# EAGLE design SparkFun_GNSS_mosaic-X5 (EAGLE 9.6.2)
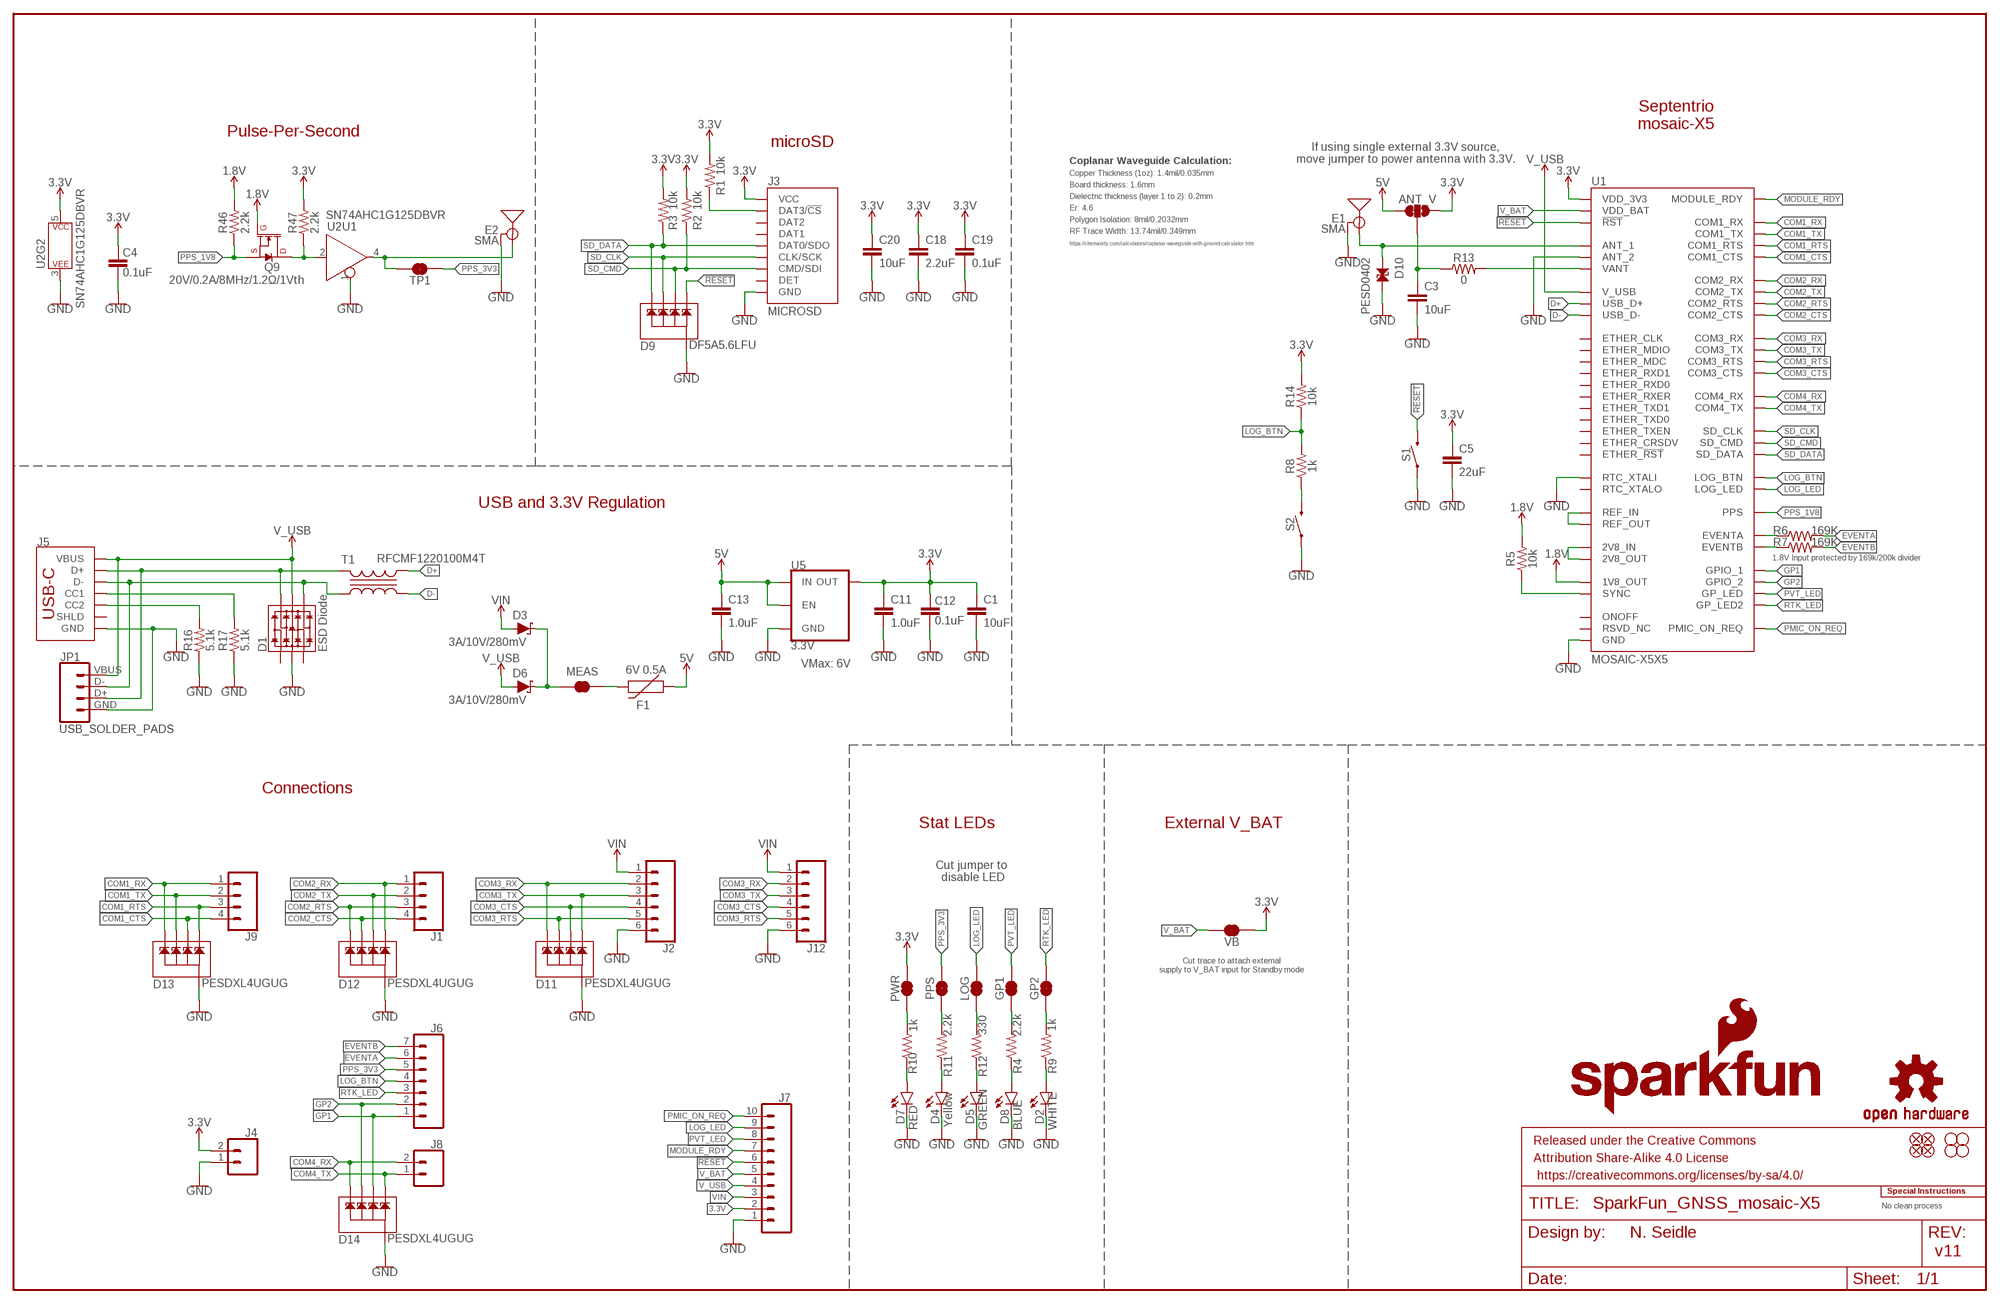
[diagram p0: schematic, sheet 1]

## Parts
ANT_V  JUMPER-SMT_3_1-NC_TRACE_SILK  [SMT-JUMPER_3_1-NC_TRACE_SILK]
C1  10uF  10UF-0603-6.3V-20%  [0603]
C3  10uF  10UF-0603-6.3V-20%  [0603]
C4  0.1uF  0.1UF-0603-25V-5%  [0603]
C5  22uF  22UF-0603-6.3V-20%  [0603]
C11  1.0uF  1.0UF-0603-16V-10%  [0603]
C12  0.1uF  0.1UF-0603-25V-5%  [0603]
C13  1.0uF  1.0UF-0603-16V-10%  [0603]
C18  2.2uF  2.2UF-0603-10V-20%  [0603]
C19  0.1uF  0.1UF-0603-25V-5%  [0603]
C20  10uF  10UF-0603-6.3V-20%  [0603]
D1  ESD Diode  TVS_DIODE_ARRAY_DT1042-04SO-7  [SOT-23-6]
D2  WHITE  LED-WHITE0603  [LED-0603]
D3  3A/10V/280mV  DIODE-SCHOTTKY-BAT60A  [SOD-323]
D4  Yellow  LED-YELLOW0603  [LED-0603]
D5  GREEN  LED-GREEN0603  [LED-0603]
D6  3A/10V/280mV  DIODE-SCHOTTKY-BAT60A  [SOD-323]
D7  RED  LED-RED0603  [LED-0603]
D8  BLUE  LED-BLUE0603  [LED-0603]
D9  DF5A5.6LFU  DF5A5.6LFUUG  [SOT353]
D10  PESD0402  PESD0402-0402T  [0402-TIGHT]
D11  PESDXL4UGUG  [SOT353]
D12  PESDXL4UGUG  [SOT353]
D13  PESDXL4UGUG  [SOT353]
D14  PESDXL4UGUG  [SOT353]
E1  SMA  ANTENNA-SMA-GROUNDEDEDGE_SMA  [SMA-EDGE]
E2  SMA  ANTENNA-SMA-GROUNDEDEDGE_SMA  [SMA-EDGE]
F1  6V 0.5A  PPTC_6V500MA  [0805]
FRAME2  FRAME-LEDGER  [CREATIVE_COMMONS]
GP1  JUMPER-SMT_2_NC_TRACE_SILK  [SMT-JUMPER_2_NC_TRACE_SILK]
GP2  JUMPER-SMT_2_NC_TRACE_SILK  [SMT-JUMPER_2_NC_TRACE_SILK]
H1  STAND-OFF  [STAND-OFF]
H2  STAND-OFF  [STAND-OFF]
H3  STAND-OFF  [STAND-OFF]
H4  STAND-OFF  [STAND-OFF]
J1  CONN_041X04_NO_SILK_NO_POP  [1X04_NO_SILK]
J2  CONN_06JST-SMD-LOCKING  [JST-6-SMD-1.25MM-LOCKING]
J3  MICROSD  MICRO-SD-PUSH-PUSH-EXT-PIN  [MICROSD-EXTERNALPIN]
J4  CONN_021X02_NO_SILK  [1X02_NO_SILK]
J5  USB Female Type C Connector  USB_C_4-LAYER_PADS  [USB-C-16P_4LAYER-PADS]
J6  CONN_07NO_SILK  [1X07_NO_SILK]
J7  CONN_10NO_SILK_PTH_FEMALE  [1X10_NO_SILK]
J8  CONN_021X02_NO_SILK  [1X02_NO_SILK]
J9  CONN_041X04_NO_SILK_NO_POP  [1X04_NO_SILK]
J12  CONN_06PAD  [1X06_SOLDER_PADS]
JP1  USB_SOLDER_PADS  [USB-SOLDER-PADS]
JP21  FIDUCIALUFIDUCIAL  [FIDUCIAL-MICRO]
JP61  FIDUCIALUFIDUCIAL  [FIDUCIAL-MICRO]
JP71  FIDUCIALUFIDUCIAL  [FIDUCIAL-MICRO]
JP81  FIDUCIALUFIDUCIAL  [FIDUCIAL-MICRO]
LOG  JUMPER-SMT_2_NC_TRACE_SILK  [SMT-JUMPER_2_NC_TRACE_SILK]
LOGO2  OSHW-LOGOMINI  [OSHW-LOGO-MINI]
LOGO4  SFE_LOGO_NAME_FLAME10_MM  [SFE_LOGO_NAME_FLAME_10MM]
MEAS  JUMPER-COMBO_2_NC_TRACE  [COMBO-JUMPER_2_NC_TRACE]
PPS  JUMPER-SMT_2_NC_TRACE_SILK  [SMT-JUMPER_2_NC_TRACE_SILK]
PWR  JUMPER-SMT_2_NC_TRACE_SILK  [SMT-JUMPER_2_NC_TRACE_SILK]
Q9  20V/0.2A/8MHz/1.2Ω/1Vth  MOSFET-NCH-RE1C002UNTCL  [SOT-416FL]
R1  10k  10KOHM-0603-1/10W-1%  [0603]
R2  10k  10KOHM-0603-1/10W-1%  [0603]
R3  10k  10KOHM-0603-1/10W-1%  [0603]
R4  2.2k  2.2KOHM-0603-1/10W-1%  [0603]
R5  10k  10KOHM-0603-1/10W-1%  [0603]
R6  169K  169KOHM  [0603]
R7  169K  169KOHM  [0603]
R8  1k  1KOHM-0603-1/10W-1%  [0603]
R9  1k  1KOHM-0603-1/10W-1%  [0603]
R10  1k  1KOHM-0603-1/10W-1%  [0603]
R11  2.2k  2.2KOHM-0603-1/10W-1%  [0603]
R12  330  330OHM-0603-1/10W-1%  [0603]
R13  0  0OHM-0603-1/10W  [0603]
R14  10k  10KOHM-0603-1/10W-1%  [0603]
R16  5.1k  5.1KOHM5.1KOHM-0603-1/10W-1%  [0603]
R17  5.1k  5.1KOHM5.1KOHM-0603-1/10W-1%  [0603]
R46  2.2k  2.2KOHM-0603-1/10W-1%  [0603]
R47  2.2k  2.2KOHM-0603-1/10W-1%  [0603]
S1  MOMENTARY-SWITCH-SPST-SMD-4.6X2.8MM  [TACTILE_SWITCH_SMD_4.6X2.8MM]
S2  MOMENTARY-SWITCH-SPST-SMD-5.2-TALL-REDUNDANT  [TACTILE_SWITCH_SMD_5.2MM]
T1  RFCMF1220100M4T  TRANSFORMER0508  [RFCMF1220100M4T]
TP1  JUMPER-SMT_2_NC_TRACE_SILK  [SMT-JUMPER_2_NC_TRACE_SILK]
U1  MOSAIC-X5X5  [MOSAIC_LGA]
U2  SN74AHC1G125DBVR  74AHC1G125SN74AHC1G125DBVR  [SOT23-5]
U5  3.3V  V_REG_AP2112K-3.3V  [SOT23-5]
U$2  SPECIAL_INSTRUCTIONS-ORDERING  [ORDERING_INSTRUCTIONS]
VB  JUMPER-SMT_2_NC_TRACE_SILK  [SMT-JUMPER_2_NC_TRACE_SILK]

## Nets
1.8V: Q9.1(G) R5.2 R46.2 U1.AC4(1V8_OUT)
3.3V [power]: ANT_V.1 C1.1 C4.2 C5.1 C11.1 C12.2 C18.1 C19.1 C20.1 J3.4(VCC) J4.2 J7.2 PWR.2 R1.2 R2.2 R3.2 R14.2 R47.2 U1.A18(VDD_3V3) U1.A19(VDD_3V3) U1.A20(VDD_3V3) U1.B18(VDD_3V3) U1.B19(VDD_3V3) U1.B20(VDD_3V3) U1.C18(VDD_3V3) U1.C19(VDD_3V3) U1.C20(VDD_3V3) U2.5(P$V+) U5.5(OUT) VB.1
5V: ANT_V.3 C13.1 F1.1 U5.1(IN) U5.3(EN)
!RESET!: D9.3 J7.6 S1.3 S1.4 U1.A11(!RST!)
ANT_V: ANT_V.2 C3.1 R13.1
CC1: J5.A5(CC1) R17.2
CC2: J5.B5(CC2) R16.2
COM1_CTS: D13.4 J9.4 U1.E1(COM1_CTS)
COM1_RTS: D13.3 J9.3 U1.C1(COM1_RTS)
COM1_RX: D13.1 J9.1 U1.B1(COM1_RX)
COM1_TX: D13.5 J9.2 U1.D1(COM1_TX)
COM2_CTS: D12.5 J1.4 U1.J1(COM2_CTS)
COM2_RTS: D12.1 J1.3 U1.G1(COM2_RTS)
COM2_RX: D12.3 J1.1 U1.F1(COM2_RX)
COM2_TX: D12.4 J1.2 U1.H1(COM2_TX)
COM3_CTS: D11.4 J2.4 J12.4 U1.N1(COM3_CTS)
COM3_RTS: D11.5 J2.5 J12.5 U1.L1(COM3_RTS)
COM3_RX: D11.1 J2.2 J12.2 U1.K1(COM3_RX)
COM3_TX: D11.3 J2.3 J12.3 U1.M1(COM3_TX)
COM4_RX: D14.1 J8.2 U1.D3(COM4_RX)
COM4_TX: D14.3 J8.1 U1.E3(COM4_TX)
D+: T1.B2 U1.A5(USB_D+)
D-: T1.A2 U1.A6(USB_D-)
EVENTA: J6.6 R6.2
EVENTB: J6.7 R7.2
GND: C1.2 C3.2 C4.1 C5.2 C11.2 C12.1 C13.2 C18.2 C19.2 C20.2 D1.2(VSS) D2.C D4.C D5.C D7.C D8.C D9.2 D10.2 D11.2 D12.2 D13.2 D14.2 E1.GND@0(GND) E1.GND@1(GND) E1.GND@2(GND) E1.GND@3(GND) E2.GND@0(GND) E2.GND@1(GND) E2.GND@2(GND) E2.GND@3(GND) J2.6 J3.6(GND) J3.10(GND) J3.11(GND) J3.12(GND) J3.13(GND) J4.1 J5.GND J5.GND2(GND) J7.1 J12.6 JP1.GND R16.1 R17.1 S1.1 S1.2 S2.1 S2.2 U1.A3(RTC_XTALI) U1.A4(GND) U1.A7(GND) U1.A15(GND) U1.A16(GND) U1.A17(GND) U1.A21(GND) U1.A22(GND) U1.A23(GND) U1.AA13(GND) U1.AA14(GND) U1.AA15(GND) U1.AA16(GND) U1.AA17(GND) U1.AA18(GND) U1.AA19(GND) U1.AA20(GND) U1.AA21(GND) U1.AA22(GND) U1.AA23(GND) U1.AB2(GND) U1.AB3(GND) U1.AB4(GND) U1.AB5(GND) U1.AB6(GND) U1.AB7(GND) U1.AB8(GND) U1.AB13(GND) U1.AB14(GND) U1.AB15(GND) U1.AB16(GND) U1.AB17(GND) U1.AB18(GND) U1.AB19(GND) U1.AB20(GND) U1.AB21(GND) U1.AB22(GND) U1.AB23(GND) U1.AC13(GND) U1.AC15(GND) U1.AC18(GND) U1.AC19(GND) U1.AC21(GND) U1.AC22(GND) U1.AC23(GND) U1.B4(GND) U1.B5(GND) U1.B6(GND) U1.B7(GND) U1.B13(GND) U1.B17(GND) U1.B21(GND) U1.C4(GND) U1.C7(GND) U1.C15(GND) U1.C16(GND) U1.C17(GND) U1.C23(GND) U1.D2(GND) U1.D21(GND) U1.D22(GND) U1.D23(GND) U1.E2(GND) U1.E21(GND) U1.E22(GND) U1.E23(GND) U1.F21(GND) U1.F22(GND) U1.F23(GND) U1.G2(GND) U1.G21(GND) U1.G23(GND) U1.H21(GND) U1.H22(GND) U1.H23(GND) U1.J21(GND) U1.J22(GND) U1.J23(GND) U1.K2(GND) U1.K21(GND) U1.K22(GND) U1.K23(GND) U1.L21(GND) U1.L22(GND) U1.L23(GND) U1.M21(GND) U1.M22(GND) U1.N21(GND) U1.N22(GND) U1.P1(GND) U1.P2(GND) U1.P3(GND) U1.P21(GND) U1.P22(GND) U1.R3(GND) U1.R21(GND) U1.R22(GND) U1.T21(GND) U1.T22(GND) U1.T23(GND) U1.U2(GND) U1.U21(GND) U1.U22(GND) U1.U23(GND) U1.V21(GND) U1.V22(GND) U1.V23(ANT_2) U1.W21(GND) U1.W22(GND) U1.W23(GND) U1.Y2(GND) U1.Y21(GND) U1.Y22(GND) U1.Y23(GND) U2.1(U1:!EN) U2.3(P$V-) U5.2(GND)
GP1: D14.4 J6.1 U1.AA4(GPIO_1)
GP2: D14.5 J6.2 U1.L3(GPIO_2)
GPS_ANT1 [RF]: D10.1 E1.SIG(SIGNAL) U1.AC20(ANT_1)
LOG_BTN: J6.4 R8.2 R14.1 U1.K3(LOG_BTN)
LOG_LED: J7.9 LOG.2 U1.B2(LOG_LED)
MEAS: D3.C D6.C MEAS.2 MEAS.4
MODULE_RDY: J7.7 U1.A12(MODULE_RDY)
N$1: R8.1 S2.3 S2.4
N$2: D4.A R11.1
N$3: PPS.1 R11.2
N$4: F1.2 MEAS.1 MEAS.3
N$5: J3.2(DAT3/!CS!) R1.1
N$6: R6.1 U1.AC6(EVENTA)
N$7: R7.1 U1.AC7(EVENTB)
N$8: D2.A R9.1
N$9: GP2.1 R9.2
N$10: U1.AC16(REF_OUT) U1.AC17(REF_IN)
N$11: D8.A R4.1
N$12: GP1.1 R4.2
N$14: D7.A R10.1
N$15: U1.M23(2V8_IN) U1.N23(2V8_OUT)
N$16: D5.A R12.1
N$17: LOG.1 R12.2
N$20: PWR.1 R10.2
N$26: R5.1 U1.AC3(SYNC)
PMIC_ON_REQ: J7.10 U1.B16(PMIC_ON_REQ)
PPS: E2.SIG(SIGNAL) TP1.2 U2.4(U1:Y)
PPS_1V8: Q9.2(S) R46.1 U1.AC8(PPS)
PPS_3: Q9.3(D) R47.1 U2.2(U1:A)
PPS_3V3: J6.5 PPS.2 TP1.1
PVT_LED: GP1.2 J7.8 U1.A14(GP_LED)
RTK_LED: GP2.2 J6.3 U1.M3(GP_LED2)
SD_CLK: D9.5 J3.5(CLK/SCK) U1.AA1(SD_CLK)
SD_CMD: D9.4 J3.3(CMD/SDI) R2.1 U1.AB1(SD_CMD)
SD_DATA: D9.1 J3.7(DAT0/SDO) R3.1 U1.Y1(SD_DATA)
USB_D+: D1.6(IO4) J5.A6(D+) J5.B6(D+) JP1.D+ T1.B1
USB_D-: D1.4(IO3) J5.A7(D-) J5.B7(D-) JP1.D- T1.A1
V_BAT: J7.5 U1.B8(VDD_BAT) VB.2
V_USB: D1.5(VCC) D6.A J5.VBUS1(VBUS) J5.VBUS2(VBUS) J7.4 JP1.VBUS U1.A8(V_USB)
VANT: R13.2 U1.P23(VANT) U1.R23(VANT)
VIN: D3.A J2.1 J7.3 J12.1
Unconnected: D1.1(IO1) D1.3(IO2) J3.1(DAT2) J3.8(DAT1) J3.9(DET) J5.SHLD1(SHLD) J5.SHLD2(SHLD) J5.SHLD3(SHLD) J5.SHLD4(SHLD) U1.A2(RTC_XTALO) U1.A9(RSVD_NC) U1.A10(ONOFF) U1.A13(RSVD_NC) U1.AA2(ETHER_CLK) U1.AA3(RSVD_NC) U1.AA5(RSVD_NC) U1.AA6(RSVD_NC) U1.AA7(RSVD_NC) U1.AA8(RSVD_NC) U1.AA9(RSVD_NC) U1.AA10(RSVD_NC) U1.AA11(RSVD_NC) U1.AA12(RSVD_NC) U1.AB9(RSVD_NC) U1.AB10(RSVD_NC) U1.AB11(RSVD_NC) U1.AB12(RSVD_NC) U1.AC1(RSVD_NC) U1.AC2(RSVD_NC) U1.AC5(RSVD_NC) U1.AC9(RSVD_NC) U1.AC10(RSVD_NC) U1.AC11(RSVD_NC) U1.AC12(RSVD_NC) U1.AC14(RSVD_NC) U1.B3(RSVD_NC) U1.B9(RSVD_NC) U1.B10(RSVD_NC) U1.B11(RSVD_NC) U1.B12(RSVD_NC) U1.B14(RSVD_NC) U1.B15(RSVD_NC) U1.B22(RSVD_NC) U1.B23(RSVD_NC) U1.C2(RSVD_NC) U1.C3(RSVD_NC) U1.C5(RSVD_NC) U1.C6(RSVD_NC) U1.C8(RSVD_NC) U1.C9(RSVD_NC) U1.C10(RSVD_NC) U1.C11(RSVD_NC) U1.C12(RSVD_NC) U1.C13(RSVD_NC) U1.C14(RSVD_NC) U1.C21(RSVD_NC) U1.C22(RSVD_NC) U1.F2(ETHER_!RST!) U1.F3(RSVD_NC) U1.G3(RSVD_NC) U1.G22(RSVD_NC) U1.H2(ETHER_TXD1) U1.H3(RSVD_NC) U1.J2(ETHER_TXD0) U1.J3(RSVD_NC) U1.L2(ETHER_TXEN) U1.M2(ETHER_RXER) U1.N2(ETHER_CRSDV) U1.N3(RSVD_NC) U1.R1(RSVD_NC) U1.R2(ETHER_RXD0) U1.T1(RSVD_NC) U1.T2(ETHER_RXD1) U1.T3(RSVD_NC) U1.U1(RSVD_NC) U1.U3(RSVD_NC) U1.V1(RSVD_NC) U1.V2(ETHER_MDC) U1.V3(RSVD_NC) U1.W1(RSVD_NC) U1.W2(ETHER_MDIO) U1.W3(RSVD_NC) U1.Y3(RSVD_NC)

## Notes on the sheet
- Septentrio
  mosaic-X5
- Pulse-Per-Second
- microSD
- If using single external 3.3V source,
  move jumper to power antenna with 3.3V.
- Coplanar Waveguide Calculation:
- Copper Thickness (1oz): 1.4mil/0.035mm
- Board thickness: 1.6mm
- Dielectric thickness (layer 1 to 2): 0.2mm
- Er: 4.6
- Polygon Isolation: 8mil/0.2032mm
- RF Trace Width: 13.74mil/0.349mm
- https://chemandy.com/calculators/coplanar-waveguide-with-ground-calculator.htm
- USB and 3.3V Regulation
- 1.8V Input protected by 169k/200k divider
- VMax: 6V
- Connections
- Stat LEDs | External V_BAT
- Cut jumper to 
  disable LED
- Cut trace to attach external
  supply to V_BAT input for Standby mode
- No clean process
- N. Seidle
- v11

## Library data of the parts
ANT_V = SparkFun-Jumpers:JUMPER-SMT_3_1-NC_TRACE: Normally closed trace jumper (1 of 2 connections) This jumper has a trace between two pads so it's normally closed (NC). The other connection is normally open (NO). Use a razor knife to open the connection. For best results follow the IPC guidelines for cutting traces: Cutout at least 0.063 mm (0.005 in). Remove all loose material to clean up the cut area. Seal the cut with an approved epoxy. Reapply solder to reclose the connection, or to close the NO connection.
C1 C3 C20 = SparkFun-Capacitors:10UF: 10.0µF ceramic capacitors A capacitor is a passive two-terminal electrical component used to store electrical energy temporarily in an electric field.; PROD_ID: CAP-11015
C4 C12 C19 = SparkFun-Capacitors:0.1UF: 0.1µF ceramic capacitors A capacitor is a passive two-terminal electrical component used to store electrical energy temporarily in an electric field.; PROD_ID: CAP-08604
C5 = SparkFun-Capacitors:22UF: 22µF ceramic capacitors A capacitor is a passive two-terminal electrical component used to store electrical energy temporarily in an electric field.; PROD_ID: CAP-14464
C11 C13 = SparkFun-Capacitors:1.0UF: 1µF ceramic capacitors A capacitor is a passive two-terminal electrical component used to store electrical energy temporarily in an electric field.; PROD_ID: CAP-00868
C18 = SparkFun-Capacitors:2.2UF: 2.2µF ceramic capacitors A capacitor is a passive two-terminal electrical component used to store electrical energy temporarily in an electric field.; PROD_ID: CAP-07888
D1 = SparkFun-DiscreteSemi:TVS_DIODE_ARRAY; PROD_ID: IC-13538
D2 = SparkFun-LED:LED-WHITE: White SMD LED Used in manufacturing several products at SparkFun. Packages: 0603 - Bright White SMD 0603 package[Product Link] <http://www.kingbrightusa.com/product.asp?catalog_name=LED&product_id=APT1608QWF/D> 1206 - Bright White SMD1206 package [Product Link] <http://www.kingbrightusa.com/product.asp?catalog_name=LED&product_id=APT3216QWF/D> 3014 - Super Bright SMD 3014 package [Datasheet] <http://www.lumileds.com/uploads/459/DS208-pdf> SparkFun Products: Blackberry Trackballer Breakout <https://www.sparkfun.com/products/13169> Digital SandBox <https://www.sparkfun.com/products/12651>; PROD_ID: DIO-09004
D3 D6 = SparkFun-DiscreteSemi:DIODE-SCHOTTKY: Schottky diode A Schottky diode is a semiconductor diode which has a low forward voltage drop and a very fast switching action.; PROD_ID: DIO-14072
D4 = SparkFun-LED:LED-YELLOW: Yellow SMD LED Used in manufacturing several products at SparkFun. Packages: 0603 - SMD 0603 package[Product Link] <http://www.kingbrightusa.com/product.asp?catalog_name=LED&product_id=APT1608SYCK> 0603 -SMART - SMART SMD 0603 package (more efficient/more expensive) [Product Link] <http://www.osram-os.com/osram_os/en/products/product-catalog/led-light-emitting-diodes/smartled-0603/ly-l29k/index.jsp> LilyPad - SMD1206 package[Product Datasheet] <https://www.sparkfun.com/datasheets/DevTools/LilyPad/Q150YUS4.pdf> SparkFun Products: Blynk Board <https://www.sparkfun.com/products/13794> IOIO-OTG <https://www.sparkfun.com/products/13613> XBee Explorer Serial <https://www.sparkfun.com/products/13225>; PROD_ID: DIO-09003
D5 = SparkFun-LED:LED-GREEN: Green SMD LED Used in manufacturing of various products at SparkFun Packages: 0603 - SMD 0603 package [Product Link] <http://www.futureelectronics.com/en/technologies/semiconductors/optoelectronics/leds/Pages/9894312-LTST-C190GKT.aspx?CrossPart=HSMG-C190&IM=0> LilyPad 1206 - SMD1206 LilyPad package [Product Link] <http://www.futureelectronics.com/en/Technologies/Product.aspx?ProductID=IN150NGHARVATEKCORPORATION2049943&IM=0> 1206 - SMD1206 package [Product Link] <http://www.futureelectronics.com/en/technologies/semiconductors/optoelectronics/leds/Pages/8315665-LTST-C150KGKT.aspx?IM=0> 1206 Bottom Mount -SMD 1206 Bottom Mount [Product Link] <http://www.digikey.com/product-detail/en/lite-on-inc/LTST-C230KGKT/160-1456-1-ND/386854> SparkFun Products: Pro Mini 328 -5V <https://www.sparkfun.com/products/821> RedBoard <https://www.sparkfun.com/products/12757> MP3 Trigger <https://www.sparkfun.com/products/13720> Makey Makey <https://www.sparkfun.com/products/11076>; PROD_ID: DIO-00821
D7 = SparkFun-LED:LED-RED: Red SMD LED Used in manufacturing of most products at SparkFun Packages: 0603 - KB - KingBright (DIO-17976) SMD 0603 package [Datasheet] <https://www.kingbrightusa.com/images/catalog/SPEC/APT1608SURCK.pdf> 0603 - (DIO-00819, has gone EOL) SMD 0603 package 0603 SMART - SMD 0603 SMART package ( more efficient and expensive)[Product Link] <http://www.osram-os.com/Graphics/XPic2/00077099_0.pdf> 1206 - SMD1206 package [Product Link] <https://www.sparkfun.com/datasheets/DevTools/LilyPad/Q150OVS4.pdff> SparkFun Products: Pro Mini 328 -5V <https://www.sparkfun.com/products/821> RedBoard <https://www.sparkfun.com/products/12757> IOIO-OTG <https://www.sparkfun.com/products/13613>; PROD_ID: DIO-00819
D8 = SparkFun-LED:LED-BLUE: Blue SMD LED Used in manufacturing of various products at SparkFun Packages: 0603 - SMD 0603 package [Product Link] <http://www.digikey.com/product-detail/en/SMLE12BC7TT86/511-1589-2-ND/1641808> 1206 - SMD1206 package [Product Link] <http://www.digikey.com/product-detail/en/lite-on-inc/LTST-C150TBKT/160-1643-1-ND/573584> SparkFun Products: ESP8266 Thing-Dev Board <https://www.sparkfun.com/products/13711> RedBoard <https://www.sparkfun.com/products/12757>; PROD_ID: DIO-08575
D9 = SparkFun-DiscreteSemi:DF5A5.6LFU; PROD_ID: DIO-20454
D10 = SparkFun-DiscreteSemi:PESD0402: ESD protection diode PESD is used to protect a signal line from ESD.; PROD_ID: DIO-15359
D11-D14 = SparkFun-DiscreteSemi:PESDXL4UG; PROD_ID: DIO-19494
E1 E2 = SparkFun-RF:ANTENNA-SMA-GROUNDED: SMA Antenna Connector w/ Ground Edge-mount and SMD SMA connectors for RF Antennas. **4-LAYER BOARD WARNING!!** When designing a 4-layer board using any of the SMD variants, you will need to manually add a cutout polygon on any internal power layers to make sure that you don't end up with exposed copper around the edge of the routed hole for these connectors. Exposed power copper could then short to the connector body - and that would be bad. Why hasn't anyone added the cutout polygons directly to the connector footprint? Well, your internal layers (usually 2 and 15) may be covered with GND polygons and you might well want the copper to go all the way to the edge, especially under the connector SIGNAL pin. So adding cutouts to the footprint might make matters worse, not better...; PROD_ID: CONN-08289
F1 = SparkFun-Fuses:PPTC: Resettable Fuse PPTC Resettable Fuse. Really a sort of resistor with a polymeric positive temperature coefficient whose resistance increases dramatically with an increase in temperature. When heated by the power passing through the resistance rises causing the current to be limited, protecting the circuit. This is achieved by the transition of the polymer from a crystalline to an amorphous state where the conductive carbon separates breaking the conductive pathways found in the cool crystalline structure. When a PPTC cools back down it resumes conducting letting the circuit turn back on. SparkFun Products: SparkFun RedBoard - Programmed with Arduino <https://www.sparkfun.com/products/12757> Pro Micro - 5V/16MHz <https://www.sparkfun.com/products/12640> Arduino Pro 328 - 5V/16MHz <https://www.sparkfun.com/products/10915> MP3 Trigger <https://www.sparkfun.com/products/13720>; PROD_ID: RES-13945
FRAME2 = SparkFun-Aesthetics:FRAME-LEDGER: Schematic Frame - Ledger Standard 11x14 US Ledger frame
GP1 GP2 LOG PPS PWR TP1 VB = SparkFun-Jumpers:JUMPER-SMT_2_NC_TRACE: Normally closed trace jumper This jumper has a trace between two pads so it's normally closed (NC). Use a razor knife to open the connection. For best results follow the IPC guidelines for cutting traces: Cutout at least 0.063 mm (0.005 in). Remove all loose material to clean up the cut area. Seal the cut with an approved epoxy. Reapply solder to reclose the connection.
H1-H4 = SparkFun-Hardware:STAND-OFF: Stand Off Drill holes for mechanically mounting via screws, standoffs, etc. Note: Use the keepout ring to avoid running the screw head into surrounding components. Variant Overviews STAND-OFF - Mechanical footprint for a #4 phillips button head screw. STAND-OFF-TIGHT - Mechanical footprint for a #4 phillips button head screw, Example SparkFun Products Screw - Phillips Head (1/4", 4-40, 10 pack) <https://www.sparkfun.com/products/10453> (PRT-10453) Screw - Phillips Head (1/2", 4-40, 10 pack) <https://www.sparkfun.com/products/10452> (PRT-10452) Screw - Phillips Head (3/4", 4-40, 10 pack) <https://www.sparkfun.com/products/10451> (PRT-10451) Screw - Phillips Head (1", 4-40, 10 pack) <https://www.sparkfun.com/products/10450> (PRT-10450)
J1 J9 = SparkFun-Connectors:CONN_04: Multi connection point. Often used as Generic Header-pin footprint for 0.1 inch spaced/style header connections On any of the 0.1 inch spaced packages, you can populate with these: Break Away Headers - Straight <https://www.sparkfun.com/products/116> (PRT-00116) Break Away Male Headers - Right Angle <https://www.sparkfun.com/products/553> (PRT-00553) Female Headers <https://www.sparkfun.com/products/115> (PRT-00115) Break Away Headers - Machine Pin <https://www.sparkfun.com/products/117> (PRT-00117) Break Away Female Headers - Swiss Machine Pin <https://www.sparkfun.com/products/743> (PRT-00743) For SCREWTERMINALS and SPRING TERMINALS visit here: Screw Terimnals on SparkFun.com <https://www.sparkfun.com/search/results?term=Screw+Terminals> (5mm/3.5mm/2.54mm spacing) This device is also useful as a general connection point to wire up your design to another part of your project. Our various solder wires solder well into these plated through hole pads. Hook-Up Wire - Assortment (Stranded, 22 AWG) <https://www.sparkfun.com/products/11375> (PRT-11375) Hook-Up Wire - Assortment (Solid Core, 22 AWG) <https://www.sparkfun.com/products/11367> (PRT-11367) View the entire wire category on our website here <https://www.sparkfun.com/categories/141> Special notes: Molex polarized connector foot print use with SKU : PRT-08231 with associated crimp pins and housings. 1MM SMD Version SKU: PRT-10208
J2 = SparkFun-Connectors:CONN_06: Multi connection point. Often used as Generic Header-pin footprint for 0.1 inch spaced/style header connections On any of the 0.1 inch spaced packages, you can populate with these: Break Away Headers - Straight <https://www.sparkfun.com/products/116> (PRT-00116) Break Away Male Headers - Right Angle <https://www.sparkfun.com/products/553> (PRT-00553) Female Headers <https://www.sparkfun.com/products/115> (PRT-00115) Break Away Headers - Machine Pin <https://www.sparkfun.com/products/117> (PRT-00117) Break Away Female Headers - Swiss Machine Pin <https://www.sparkfun.com/products/743> (PRT-00743) Arduino Stackable Header - 6 Pin <https://www.sparkfun.com/products/9280> (PRT-09280) Screw Terminals 2.54mm Pitch (6-Pin) <https://www.sparkfun.com/products/16499> (PRT-16499) For SCREWTERMINALS and SPRING TERMINALS visit here: Screw Terimnals on SparkFun.com <https://www.sparkfun.com/search/results?term=Screw+Terminals> (5mm/3.5mm/2.54mm spacing) This device is also useful as a general connection point to wire up your design to another part of your project. Our various solder wires solder well into these plated through hole pads. Hook-Up Wire - Assortment (Stranded, 22 AWG) <https://www.sparkfun.com/products/11375> (PRT-11375) Hook-Up Wire - Assortment (Solid Core, 22 AWG) <https://www.sparkfun.com/products/11367> (PRT-11367) View the entire wire category on our website here <https://www.sparkfun.com/categories/141>; PROD_ID: CONN-16497
J3 = SparkFun-Connectors:MICRO-SD: microSD Socket for Transflash Various sockets for µSD. tDoc lines correctly indicate media card edge positions when inserting (unlocked, locked, depressed). NOTE: CD1 and CD2 are connected internally, and the default detect state of the socket is detect pin to ground. SparkFun Products: WAV Trigger <https://www.sparkfun.com/products/13660> CAN-Bus Shield <https://www.sparkfun.com/products/13262> SparkFun Level Shifing microSD Breakout <https://www.sparkfun.com/products/13743>; PROD_ID: CONN-16110
J4 J8 = SparkFun-Connectors:CONN_02: Multi connection point. Often used as Generic Header-pin footprint for 0.1 inch spaced/style header connections On any of the 0.1 inch spaced packages, you can populate with these: Break Away Headers - Straight <https://www.sparkfun.com/products/116> (PRT-00116) Break Away Male Headers - Right Angle <https://www.sparkfun.com/products/553> (PRT-00553) Female Headers <https://www.sparkfun.com/products/115> (PRT-00115) Break Away Headers - Machine Pin <https://www.sparkfun.com/products/117> (PRT-00117) Break Away Female Headers - Swiss Machine Pin <https://www.sparkfun.com/products/743> (PRT-00743) For SCREWTERMINALS and SPRING TERMINALS visit here: Screw Terimnals on SparkFun.com <https://www.sparkfun.com/search/results?term=Screw+Terminals> (5mm/3.5mm/2.54mm spacing) This device is also useful as a general connection point to wire up your design to another part of your project. Our various solder wires solder well into these plated through hole pads. Hook-Up Wire - Assortment (Stranded, 22 AWG) <https://www.sparkfun.com/products/11375> (PRT-11375) Hook-Up Wire - Assortment (Solid Core, 22 AWG) <https://www.sparkfun.com/products/11367> (PRT-11367) View the entire wire category on our website here <https://www.sparkfun.com/categories/141> Special notes: Molex polarized connector foot print use with: PRT-08233 with associated crimp pins and housings. 2.54_SCREWTERM for use with PRT-10571. 3.5mm Screw Terminal footprints for PRT-08084 5mm Screw Terminal footprints for use with PRT-08432
J5 = SparkFun-Connectors:USB_C: USB Type C 16Pin Connector Super Speed pins not available on the 16-pin purely SMD connector so this part is best for USB 2.0 implementations. D1 and D2 are tied together enabling D+/- no matter which way the cable is plugged into the connector. The two channel configuration pins (CC1/2) are exposed. These are normally connected to ground via 5.1k resistors but can be reconfigured for high current/high power applications. **4-LAYER BOARD WARNING!!** If designing 4-layer board, make sure to select the variant _4-LAYER-ISOLATED. The linked footprint (USB-C-16-4LAYER-ISOLATED) includes some very necessary cutout polygons in the inner layers (2 and 15). This prevents the PTH mounting shield legs on the USB connector from electrically connecting any other polygons on the inner layers (usually VCC and GND).; PROD_ID: CONN-14122
J6 = SparkFun-Connectors:CONN_07: Multi connection point. Often used as Generic Header-pin footprint for 0.1 inch spaced/style header connections On any of the 0.1 inch spaced packages, you can populate with these: Break Away Headers - Straight <https://www.sparkfun.com/products/116> (PRT-00116) Break Away Male Headers - Right Angle <https://www.sparkfun.com/products/553> (PRT-00553) Female Headers <https://www.sparkfun.com/products/115> (PRT-00115) Break Away Headers - Machine Pin <https://www.sparkfun.com/products/117> (PRT-00117) Break Away Female Headers - Swiss Machine Pin <https://www.sparkfun.com/products/743> (PRT-00743) For SCREWTERMINALS and SPRING TERMINALS visit here: Screw Terimnals on SparkFun.com <https://www.sparkfun.com/search/results?term=Screw+Terminals> (5mm/3.5mm/2.54mm spacing) This device is also useful as a general connection point to wire up your design to another part of your project. Our various solder wires solder well into these plated through hole pads. Hook-Up Wire - Assortment (Stranded, 22 AWG) <https://www.sparkfun.com/products/11375> (PRT-11375) Hook-Up Wire - Assortment (Solid Core, 22 AWG) <https://www.sparkfun.com/products/11367> (PRT-11367) View the entire wire category on our website here <https://www.sparkfun.com/categories/141> Special notes: Molex polarized connector foot print use with SKU : PRT-08231 with associated crimp pins and housings. 1MM SMD Version SKU: PRT-10208 NOTES ON THE VARIANTS LOCK and LOCK_LONGPADS... This footprint was designed to help hold the alignment of a through-hole component (i.e. 6-pin header) while soldering it into place. You may notice that each hole has been shifted either up or down by 0.005 of an inch from it's more standard position (which is a perfectly straight line). This slight alteration caused the pins (the squares in the middle) to touch the edges of the holes. Because they are alternating, it causes a "brace" to hold the component in place. 0.005 has proven to be the perfect amount of "off-center" position when using our standard breakaway headers. Although looks a little odd when you look at the bare footprint, once you have a header in there, the alteration is very hard to notice. Also,if you push a header all the way into place, it is covered up entirely on the bottom side.
J7 = SparkFun-Connectors:CONN_10: Multi connection point. Often used as Generic Header-pin footprint for 0.1 inch spaced/style header connections On any of the 0.1 inch spaced packages, you can populate with these: Break Away Headers - Straight <https://www.sparkfun.com/products/116> (PRT-00116) Break Away Male Headers - Right Angle <https://www.sparkfun.com/products/553> (PRT-00553) Female Headers <https://www.sparkfun.com/products/115> (PRT-00115) Break Away Headers - Machine Pin <https://www.sparkfun.com/products/117> (PRT-00117) Break Away Female Headers - Swiss Machine Pin <https://www.sparkfun.com/products/743> (PRT-00743) Arduino Stackable Header - 10 Pin <https://www.sparkfun.com/products/11376> (PRT-11376) For SCREWTERMINALS and SPRING TERMINALS visit here: Screw Terimnals on SparkFun.com <https://www.sparkfun.com/search/results?term=Screw+Terminals> (5mm/3.5mm/2.54mm spacing) This device is also useful as a general connection point to wire up your design to another part of your project. Our various solder wires solder well into these plated through hole pads. Hook-Up Wire - Assortment (Stranded, 22 AWG) <https://www.sparkfun.com/products/11375> (PRT-11375) Hook-Up Wire - Assortment (Solid Core, 22 AWG) <https://www.sparkfun.com/products/11367> (PRT-11367) View the entire wire category on our website here <https://www.sparkfun.com/categories/141> Special notes: Molex polarized connector foot print use with SKU : PRT-08231 with associated crimp pins and housings. 1MM SMD Version SKU: PRT-10208 NOTES ON THE VARIANTS LOCK and LOCK_LONGPADS... This footprint was designed to help hold the alignment of a through-hole component (i.e. 6-pin header) while soldering it into place. You may notice that each hole has been shifted either up or down by 0.005 of an inch from it's more standard position (which is a perfectly straight line). This slight alteration caused the pins (the squares in the middle) to touch the edges of the holes. Because they are alternating, it causes a "brace" to hold the component in place. 0.005 has proven to be the perfect amount of "off-center" position when using our standard breakaway headers. Although looks a little odd when you look at the bare footprint, once you have a header in there, the alteration is very hard to notice. Also,if you push a header all the way into place, it is covered up entirely on the bottom side.
J12 = SparkFun-Connectors:CONN_06: Multi connection point. Often used as Generic Header-pin footprint for 0.1 inch spaced/style header connections On any of the 0.1 inch spaced packages, you can populate with these: Break Away Headers - Straight <https://www.sparkfun.com/products/116> (PRT-00116) Break Away Male Headers - Right Angle <https://www.sparkfun.com/products/553> (PRT-00553) Female Headers <https://www.sparkfun.com/products/115> (PRT-00115) Break Away Headers - Machine Pin <https://www.sparkfun.com/products/117> (PRT-00117) Break Away Female Headers - Swiss Machine Pin <https://www.sparkfun.com/products/743> (PRT-00743) Arduino Stackable Header - 6 Pin <https://www.sparkfun.com/products/9280> (PRT-09280) Screw Terminals 2.54mm Pitch (6-Pin) <https://www.sparkfun.com/products/16499> (PRT-16499) For SCREWTERMINALS and SPRING TERMINALS visit here: Screw Terimnals on SparkFun.com <https://www.sparkfun.com/search/results?term=Screw+Terminals> (5mm/3.5mm/2.54mm spacing) This device is also useful as a general connection point to wire up your design to another part of your project. Our various solder wires solder well into these plated through hole pads. Hook-Up Wire - Assortment (Stranded, 22 AWG) <https://www.sparkfun.com/products/11375> (PRT-11375) Hook-Up Wire - Assortment (Solid Core, 22 AWG) <https://www.sparkfun.com/products/11367> (PRT-11367) View the entire wire category on our website here <https://www.sparkfun.com/categories/141>
JP1 = SparkFun-Connectors:USB_SOLDER_PADS: Solder pad access to USB pins. Helpful to expose on PCBs so user can attach external USB connector if necessary.
JP21 JP61 JP71 JP81 = SparkFun-Aesthetics:FIDUCIAL: Fiducial Alignment Points Point-of-reference for pick-and-place machines and other optical instruments.
LOGO2 = SparkFun-Aesthetics:OSHW-LOGO: Open-Source Hardware (OSHW) Logo This logo indicates the piece of hardware it is found on incorporates a OSHW license and/or adheres to the definition of open source hardware found here: http://freedomdefined.org/OSHW
LOGO4 = SparkFun-Aesthetics:SFE_LOGO_NAME_FLAME: SparkFun Font Logo w/ Flame This is the SparkFun full logo. The logo on the schematic will always be the same size; the package variant is the height of the flame part of the logo. Default layer for the logo on the board is tSilk.
MEAS = SparkFun-Jumpers:JUMPER-COMBO_2_NC_TRACE
Q9 = SparkFun-DiscreteSemi:MOSFET-NCH: N-channel MOSFETs Voltage controlled devices that allow control of high current outputs. SparkFun Products: SparkFun OpenScale <https://www.sparkfun.com/products/13261> SparkFun Digital Sandbox <https://www.sparkfun.com/products/12651> SparkFun Monster Moto Shield <https://www.sparkfun.com/products/10182> SparkFun MOSFET Power Controller <https://www.sparkfun.com/products/11214>; PROD_ID: TRANS-14399
R1-R3 R5 R14 = SparkFun-Resistors:10KOHM: 10kΩ resistor A resistor is a passive two-terminal electrical component that implements electrical resistance as a circuit element. Resistors act to reduce current flow, and, at the same time, act to lower voltage levels within circuits. - Wikipedia; PROD_ID: RES-00824
R4 R11 R46 R47 = SparkFun-Resistors:2.2KOHM: 2.2kΩ resistor A resistor is a passive two-terminal electrical component that implements electrical resistance as a circuit element. Resistors act to reduce current flow, and, at the same time, act to lower voltage levels within circuits. - Wikipedia; PROD_ID: RES-08272
R6 R7 = SparkFun-Resistors:169KOHM: 169kΩ resistor A resistor is a passive two-terminal electrical component that implements electrical resistance as a circuit element. Resistors act to reduce current flow, and, at the same time, act to lower voltage levels within circuits. - Wikipedia; PROD_ID: RES-14394
R8-R10 = SparkFun-Resistors:1KOHM: 1kΩ resistor A resistor is a passive two-terminal electrical component that implements electrical resistance as a circuit element. Resistors act to reduce current flow, and, at the same time, act to lower voltage levels within circuits. - Wikipedia; PROD_ID: RES-07856
R12 = SparkFun-Resistors:330OHM: 330Ω resistor A resistor is a passive two-terminal electrical component that implements electrical resistance as a circuit element. Resistors act to reduce current flow, and, at the same time, act to lower voltage levels within circuits. - Wikipedia; PROD_ID: RES-00818
R13 = SparkFun-Resistors:0OHM: 0Ω resistor A resistor is a passive two-terminal electrical component that implements electrical resistance as a circuit element. Resistors act to reduce current flow, and, at the same time, act to lower voltage levels within circuits. - Wikipedia; PROD_ID: RES-08609
R16 R17 = SparkFun-Resistors:5.1KOHM; PROD_ID: RES-12083
S1 = SparkFun-Switches:MOMENTARY-SWITCH-SPST: Momentary Switch (Pushbutton) - SPST Normally-open (NO) SPST momentary switches (buttons, pushbuttons). Variants PTH-12MM - 12mm square, through-hole Momentary Pushbutton Switch - 12mm Square <https://www.sparkfun.com/products/9190> (COM-09190) PTH-6.0MM, PTH-6.0MM-KIT - 6.0mm square, through-hole Mini Pushbutton Switch <https://www.sparkfun.com/products/97> (COM-00097) KIT package intended for soldering kit's - only one side of pads' copper is exposed. PTH-RIGHT-ANGLE-KIT - Right-angle, through-hole Right Angle Tactile Button <https://www.sparkfun.com/products/10791> - Used on SparkFun BigTime Watch Kit <https://www.sparkfun.com/products/11734> SMD-12MM - 12mm square, surface-mount Tactile Button - SMD (12mm) <https://www.sparkfun.com/products/12993> (COM-12993) Used on SparkFun PicoBoard <https://www.sparkfun.com/products/11888> SMD-4.5MM - 4.5mm Square Trackball Switch Used on SparkFun Blackberry Trackballer Breakout <https://www.sparkfun.com/products/13169> SMD-4.6MMX2.8MM - 4.60mm x 2.80mm, surface mount Used on SparkFun Pro Micro - RP2040 <https://www.sparkfun.com/products/17717> SMD-5.2MM, SMD-5.2-REDUNDANT - 5.2mm square, surface-mount Mini Pushbutton Switch - SMD <https://www.sparkfun.com/products/8720> (COM-08720) Used on Arduino Pro Mini <https://www.sparkfun.com/products/11114> REDUNDANT package connects both switch circuits together SMD-6.0X3.5MM - 6.0 x 3.5mm, surface mount Momentary Reset Switch SMD <https://www.sparkfun.com/products/8229> (COM-08229) SMD-6.2MM-TALL - 6.2mm square, surface mount Tactile Button - SMD (6mm) <https://www.sparkfun.com/products/12992> Used on SparkFun Digital Sandbox <https://www.sparkfun.com/products/12651> SMD-RIGHT-ANGLE - Right-angle, surface mount Used on SparkFun Block for Intel® Edison - Arduino <https://www.sparkfun.com/products/13036>; PROD_ID: SWCH-15606
S2 = SparkFun-Switches:MOMENTARY-SWITCH-SPST: Momentary Switch (Pushbutton) - SPST Normally-open (NO) SPST momentary switches (buttons, pushbuttons). Variants PTH-12MM - 12mm square, through-hole Momentary Pushbutton Switch - 12mm Square <https://www.sparkfun.com/products/9190> (COM-09190) PTH-6.0MM, PTH-6.0MM-KIT - 6.0mm square, through-hole Mini Pushbutton Switch <https://www.sparkfun.com/products/97> (COM-00097) KIT package intended for soldering kit's - only one side of pads' copper is exposed. PTH-RIGHT-ANGLE-KIT - Right-angle, through-hole Right Angle Tactile Button <https://www.sparkfun.com/products/10791> - Used on SparkFun BigTime Watch Kit <https://www.sparkfun.com/products/11734> SMD-12MM - 12mm square, surface-mount Tactile Button - SMD (12mm) <https://www.sparkfun.com/products/12993> (COM-12993) Used on SparkFun PicoBoard <https://www.sparkfun.com/products/11888> SMD-4.5MM - 4.5mm Square Trackball Switch Used on SparkFun Blackberry Trackballer Breakout <https://www.sparkfun.com/products/13169> SMD-4.6MMX2.8MM - 4.60mm x 2.80mm, surface mount Used on SparkFun Pro Micro - RP2040 <https://www.sparkfun.com/products/17717> SMD-5.2MM, SMD-5.2-REDUNDANT - 5.2mm square, surface-mount Mini Pushbutton Switch - SMD <https://www.sparkfun.com/products/8720> (COM-08720) Used on Arduino Pro Mini <https://www.sparkfun.com/products/11114> REDUNDANT package connects both switch circuits together SMD-6.0X3.5MM - 6.0 x 3.5mm, surface mount Momentary Reset Switch SMD <https://www.sparkfun.com/products/8229> (COM-08229) SMD-6.2MM-TALL - 6.2mm square, surface mount Tactile Button - SMD (6mm) <https://www.sparkfun.com/products/12992> Used on SparkFun Digital Sandbox <https://www.sparkfun.com/products/12651> SMD-RIGHT-ANGLE - Right-angle, surface mount Used on SparkFun Block for Intel® Edison - Arduino <https://www.sparkfun.com/products/13036>; PROD_ID: SWCH-14139
T1 = SparkFun-Coils:TRANSFORMER: Small transformers; PROD_ID: COMP-19495
U1 = Septentrio_mosaic-X5:MOSAIC-X5; PROD_ID: GPS-19395
U2 = SparkFun-IC-Logic:74*1G125: Single buffer Buffers & Line Drivers Tri-State Single Bus SOT-23-5 Datasheet SparkFun Products SparkFun SAMD21 Mini Breakout <https://www.sparkfun.com/products/13664> (DEV-13664) SparkFun SAMD21 Dev Breakout <https://www.sparkfun.com/products/13672> (DEV-13672) SparkFun MIDI Shield <https://www.sparkfun.com/products/12898> (DEV-12898) SparkFun WiFi Shield - CC3000 <https://www.sparkfun.com/products/12071> (DEV-12071) SparkFun Tsunami Super WAV Trigger (Qwiic) <https://www.sparkfun.com/products/18159> (DEV-18159); PROD_ID: IC-11920
U5 = SparkFun-IC-Power:V_REG_AP2112: AP2112 - 600mA CMOS LDO Regulator w/ Enable The AP2112 is CMOS process low dropout linear regulator with enable function, the regulator delivers a guaranteed 600mA (min.) continuous load current. Features Output Voltage Accuracy: ±1.5% Output Current: 600mA (Min.) Foldback Short Current Protection: 50mA Enable Function to Turn ON/OFF VOUT Low Dropout Voltage (3.3V): 250mV (Typ.) @IOUT=600mA Excellent Load Regulation: 0.2%/A (Typ.) Excellent Line Regulation: 0.02%/V (Typ.) Low Quiescent Current: 55μA (Typ.) Low Standby Current: 0.01μA (Typ.) Low Output Noise: 50μVRMS PSRR: 100Hz -65dB, 1kHz -65dB OTSD Protection Stable with 1.0μF Flexible Cap: Ceramic, Tantalum and Aluminum Electrolytic Operation Temperature Range: -40°C to 85°C ESD: MM 400V, HBM 4000V; PROD_ID: VREG-12457
U$2 = SparkFun-Aesthetics:SPECIAL_INSTRUCTIONS: Special Ordering/Production Instructions Alert Symbol for special PCB ordering instructions or unique production process warnings. Ordering Instructions Production Instructions Types of information that should be added to box: Copper weight Soldermask color Silk color PCB thickness Number of layers PCB Standard: 1.6mm FR4 1 oz copper immersion silver plating red soldermask white silkscreen Types of information that should be added to box: Special wash requirements Depaneling instructions Humidification Glue curing Default text settings: 0.07 inch 9% ratio 50% line distance

## Net classes
1 power: width 0.178 mm
2 3.3V: width 0.508 mm, drill 0.305 mm
3 RF: width 0.349 mm, clearance 0.203 mm

## Board
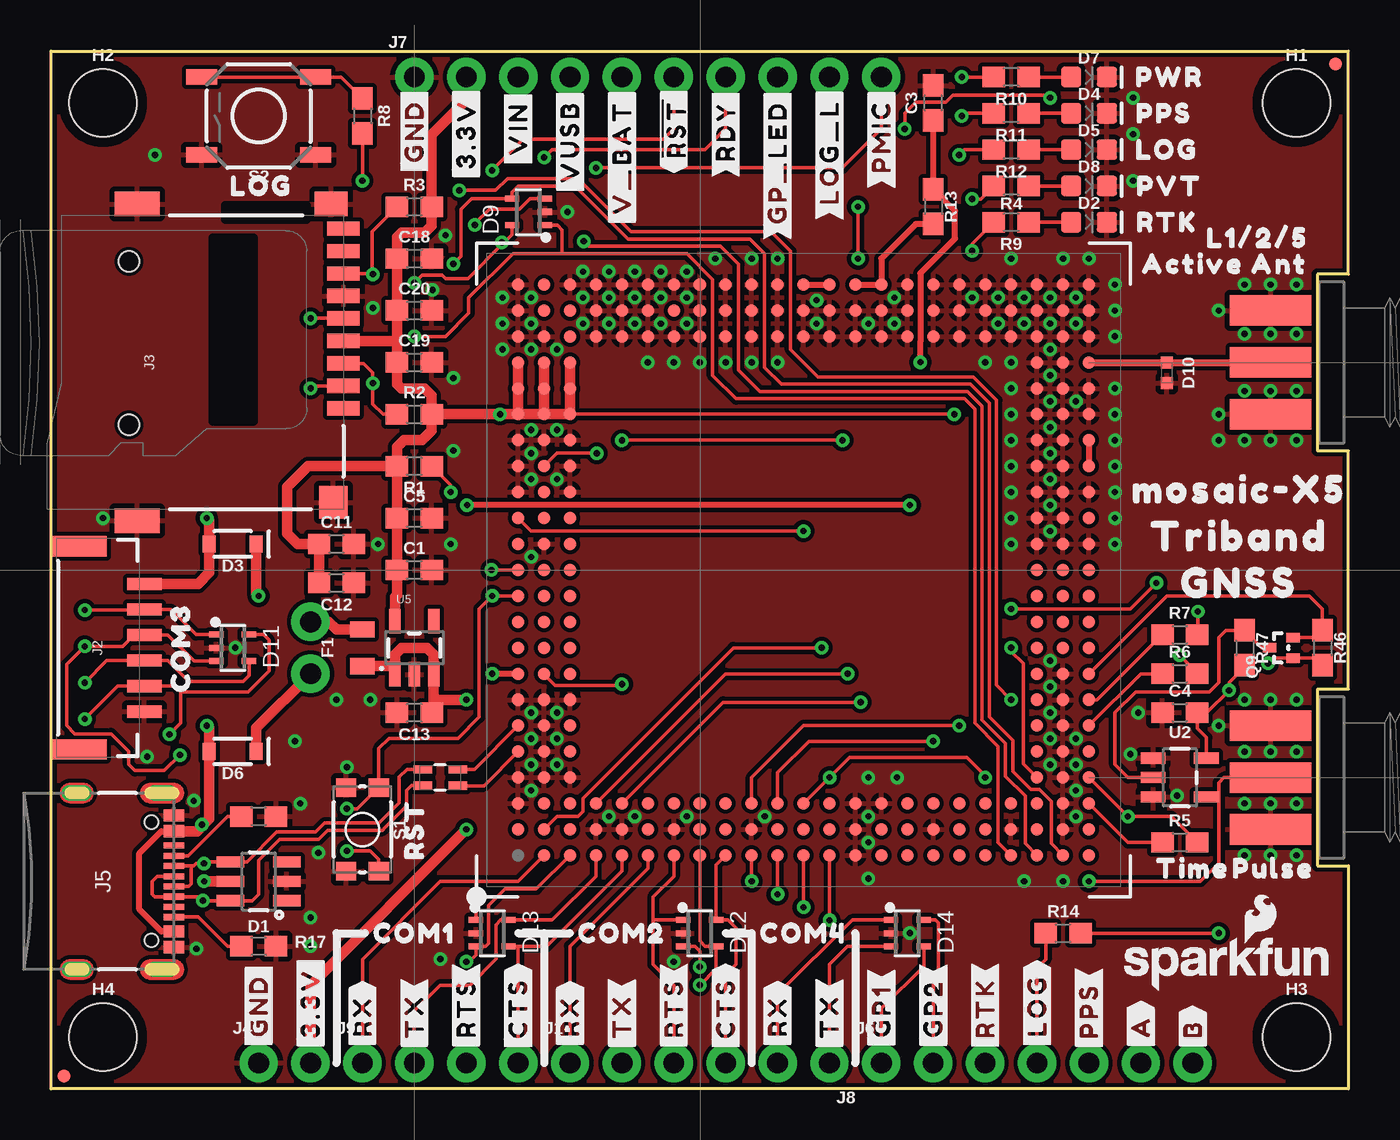
[diagram p1: board, top side]
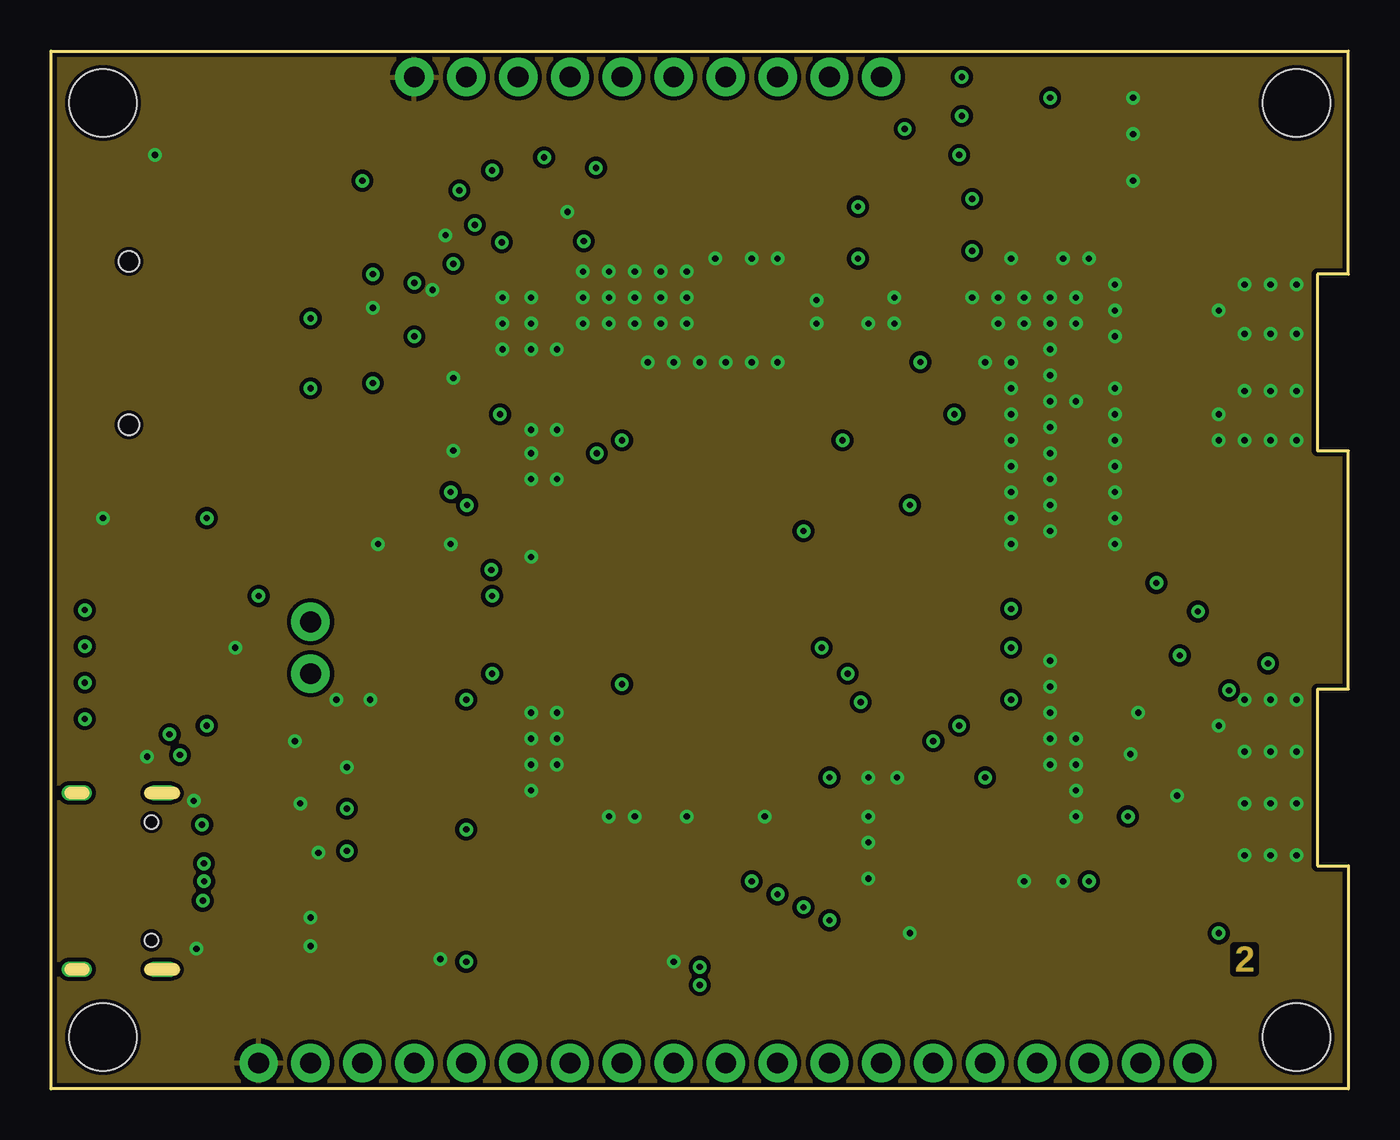
[diagram p2: board, inner layer GND/Horz]
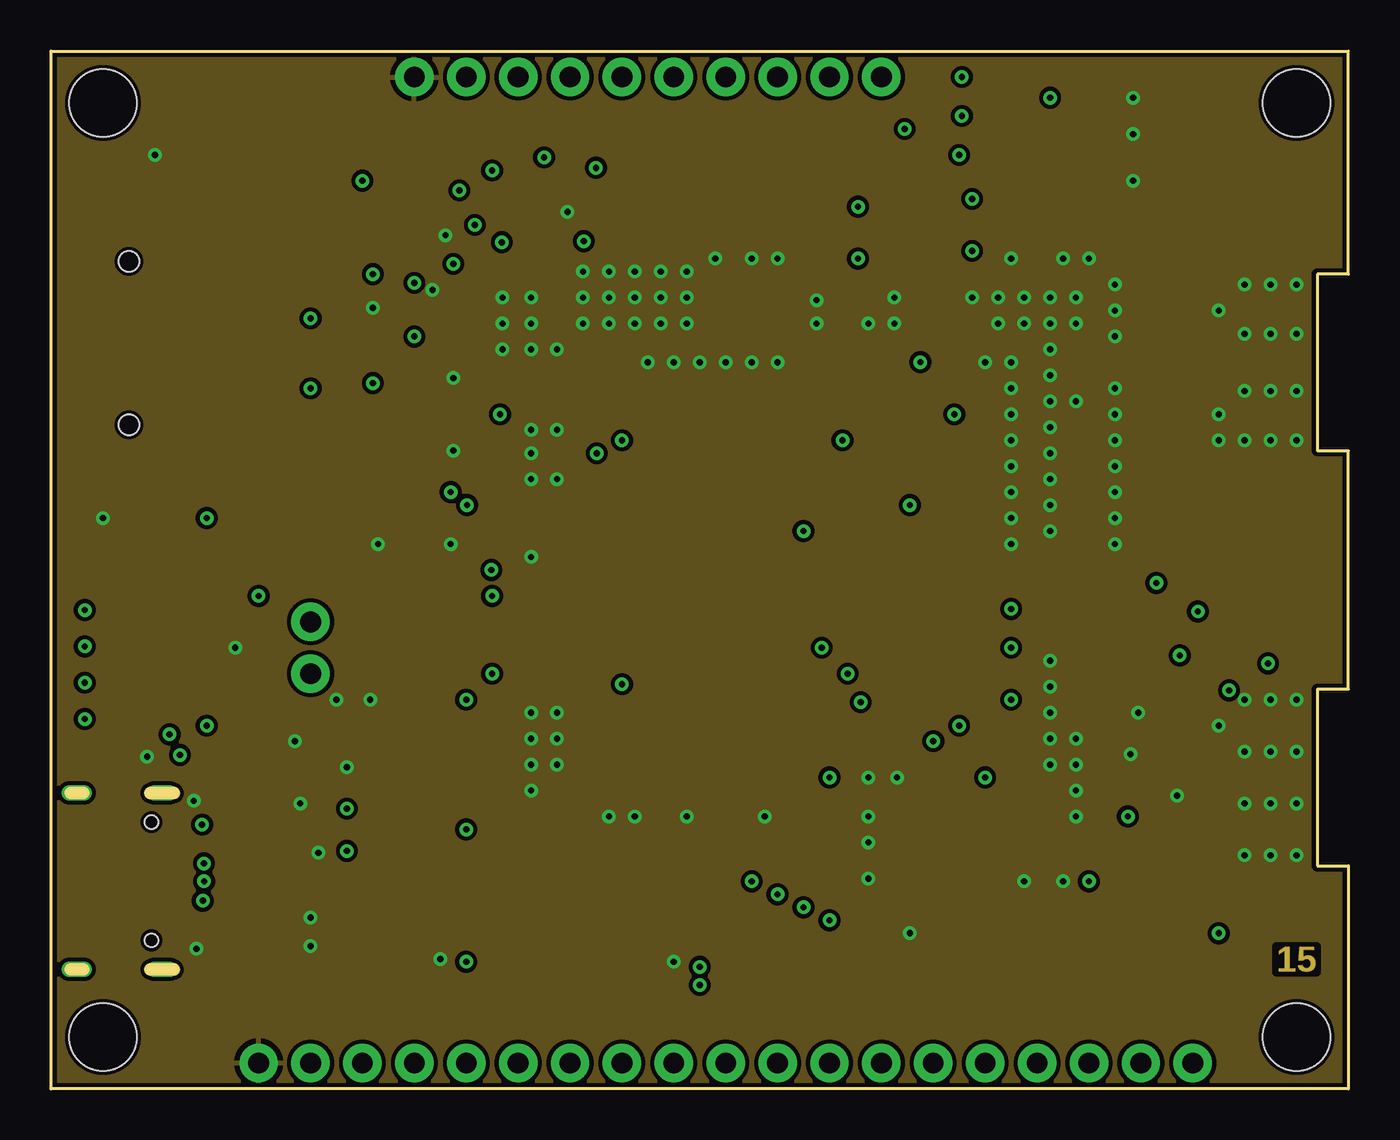
[diagram p3: board, inner layer Vert]
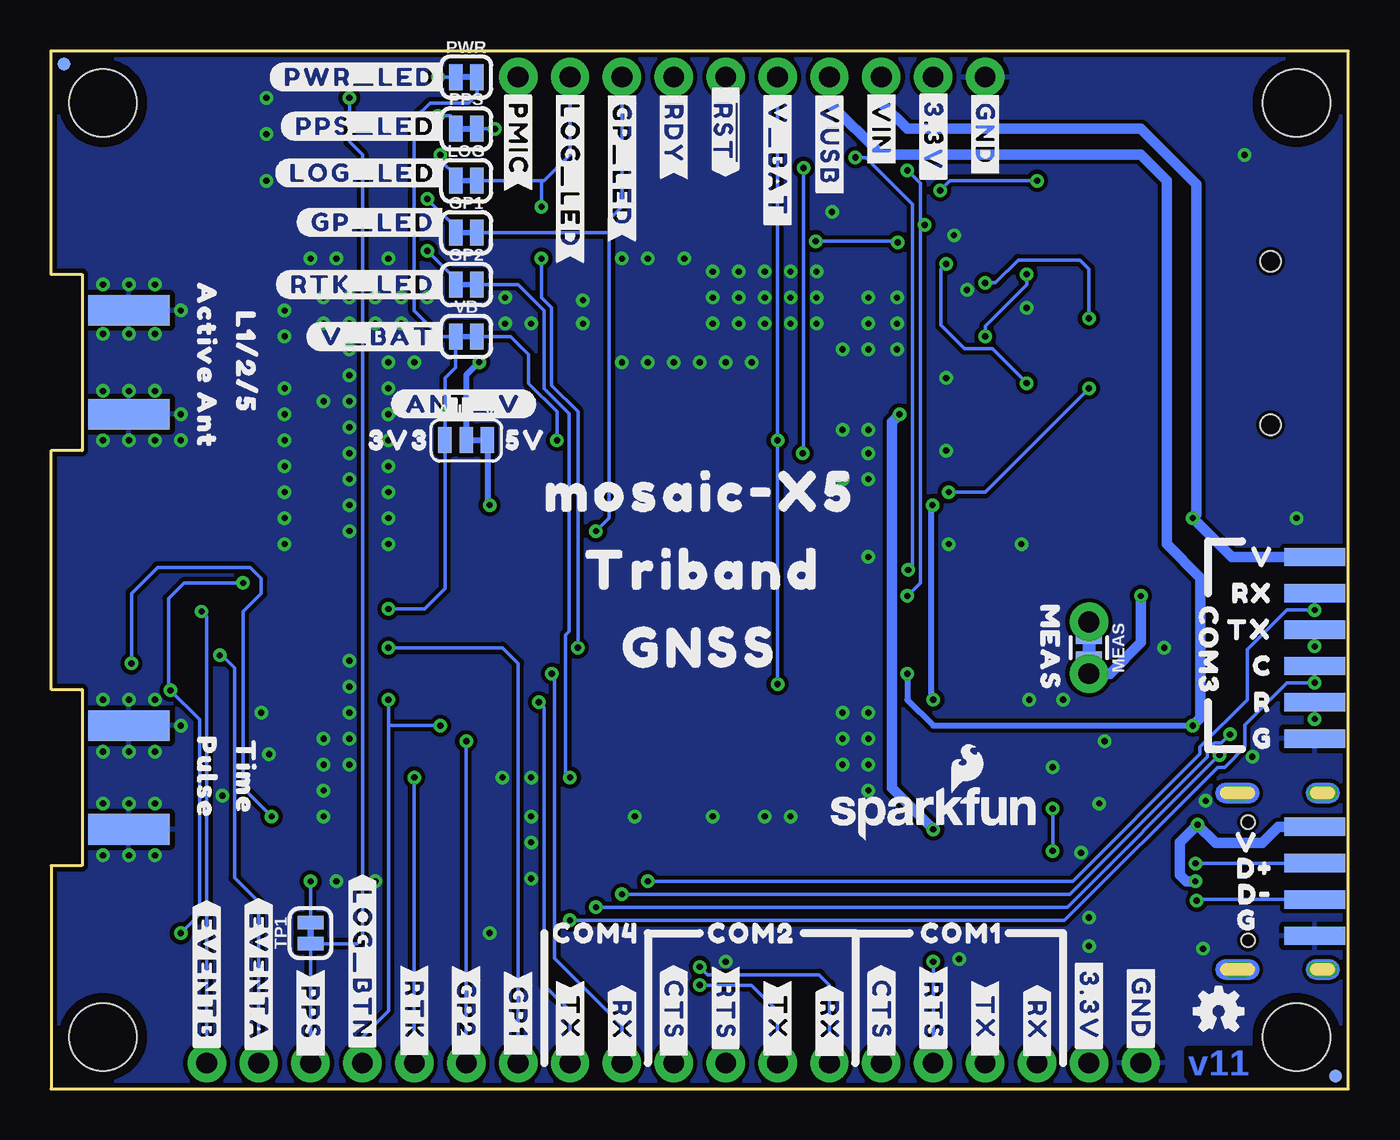
[diagram p4: board, bottom side, seen from below]

Size 63.5 x 50.8 mm. Coordinates in mm from the lower left corner, seen from the top.
Outline: 0,0 0,50.8 63.5,50.8 63.5,39.88 61.98,39.88 61.98,31.24 63.5,31.24 63.5,19.56 61.98,19.56 61.98,10.92 63.5,10.92 63.5,0 0,0
Copper layers (1+2*15+16): Top/Horz 0.035559375mm / dielectric 0.47751875mm / GND/Horz 0.035559375mm / dielectric 0.47751875mm / Vert 0.035559375mm / dielectric 0.47751875mm / Bottom/Vert 0.035559375mm
Design rules "SparkFun-4-Layer-General-JLCPCB": minimum track width 7mil, minimum drill 12mil, track to track 7mil, track to pad 7mil, pad to pad 7mil, via to via 7mil, smd to smd 7mil, copper to edge 7mil, drill to drill 7mil, minimum pad ring 7mil, minimum via ring 7mil, stop-mask expansion 3mil, vias tented up to drill 25mil, thermal gap 10mil

### Footprints (pad centres in the part's own frame; a part is rotated, then mirrored left to right if it is on the bottom)
SMT-JUMPER_3_1-NC_TRACE_SILK = smd 0.66 x 1.27: 1 -1.041,0; 2 0,0; 3 1.041,0
0603 = smd 1.1 x 1: 1 -0.85,0; 2 0.85,0
SOT-23-6 = smd 0.55 x 1.35: 1 -0.95,-1.375; 2 0,-1.375; 3 0.95,-1.375; 4 0.95,1.375; 5 0,1.375; 6 -0.95,1.375
LED-0603 = smd 1 x 1: A -0.877,0; C 0.877,0
SOD-323 = smd 0.63 x 0.83: A 1.15,0; C -1.15,0
SOT353 = smd 0.3 x 0.7: 1 -0.65,-0.8; 2 0,-0.8; 3 0.65,-0.8; 4 0.65,0.8; 5 -0.65,0.8
0402-TIGHT = smd 0.6 x 0.6: 1 -0.5,0; 2 0.5,0
SMA-EDGE = smd 1.5 x 4: GND@0 -2.54,0; GND@1 2.54,0; SIG 0,0 | smd 1.5 x 4 bottom: GND@2 -2.54,0; GND@3 2.54,0
0805 = smd 0.8 x 1.2: 1 -0.9,0; 2 0.9,0
SMT-JUMPER_2_NC_TRACE_SILK = smd 0.66 x 1.27: 1 -0.521,0; 2 0.521,0
STAND-OFF = hole 3.302: 0,0
1X04_NO_SILK = drill 1.016 pad 1.88: 1 0,0; 2 2.54,0; 3 5.08,0; 4 7.62,0
JST-6-SMD-1.25MM-LOCKING = smd 0.6 x 1.7: 1 -3.125,3.3; 2 -1.875,3.3; 3 -0.625,3.3; 4 0.625,3.3; 5 1.875,3.3; 6 3.125,3.3 | smd 1 x 2.7: NC1 4.975,0.1; NC2 -4.975,0.1
MICROSD-EXTERNALPIN = smd 0.7 x 1.6: 1 2.25,10.5; 2 1.15,10.5; 3 0.05,10.5; 4 -1.05,10.5; 5 -2.15,10.5; 6 -3.25,10.5; 7 -4.35,10.5; 8 -5.45,10.5; 9 -6.55,10.5 | smd 1.2 x 1.6: 10 -7.75,9.9 | smd 1.2 x 2.2: 11 -7.75,0.4; 12 7.75,0.4 | smd 1.6 x 1.4: 13 6.85,10 | hole 1: 3.05,0; -4.95,0
1X02_NO_SILK = drill 1.016 pad 1.88: 1 0,0; 2 2.54,0
USB-C-16P_4LAYER-PADS = smd 0.3 x 1: A5 -1.25,-0.34; A6 -0.25,-0.34; A7 0.25,-0.34; A8 1.25,-0.34; B5 1.75,-0.34; B6 0.75,-0.34; B7 -0.75,-0.34; B8 -1.75,-0.34 | smd 0.6 x 1: GND -3.225,-0.34; GND2 3.225,-0.34; VBUS1 -2.45,-0.34; VBUS2 2.45,-0.34 | drill 0.4 pad 0.6 long: SHLD1 -4.318,-0.915; SHLD2 4.318,-0.915; SHLD3 -4.318,-5.095; SHLD4 4.318,-5.095 | hole 0.65: -2.89,-1.445; 2.89,-1.445
1X07_NO_SILK = drill 1.016 pad 1.88: 1 0,0; 2 2.54,0; 3 5.08,0; 4 7.62,0; 5 10.16,0; 6 12.7,0; 7 15.24,0
1X10_NO_SILK = drill 1.016 pad 1.88: 1 0,0; 2 2.54,0; 3 5.08,0; 4 7.62,0; 5 10.16,0; 6 12.7,0; 7 15.24,0; 8 17.78,0; 9 20.32,0; 10 22.86,0
1X06_SOLDER_PADS = smd 3 x 0.9: 1 0,4.445; 2 0,2.667; 3 0,0.889; 4 0,-0.889; 5 0,-2.667; 6 0,-4.445
USB-SOLDER-PADS = smd 3 x 0.9: D+ 0,-0.889; D- 0,0.889; GND 0,-2.667; VBUS 0,2.667
FIDUCIAL-MICRO = smd 0.635 x 0.635: 1 0,0
COMBO-JUMPER_2_NC_TRACE = smd 0.635 x 1.27: 1 -0.508,0; 2 0.508,0 | drill 1.016 pad 1.88: 3 -1.27,0; 4 1.27,0
SOT-416FL = smd 0.46 x 0.65: 1 -0.5,-1.1; 2 0.5,-1.1; 3 0,0.05
TACTILE_SWITCH_SMD_4.6X2.8MM = smd 0.9 x 1: 1 -2.05,-0.8; 2 2.05,-0.8; 3 2.05,0.8; 4 -2.05,0.8
TACTILE_SWITCH_SMD_5.2MM = smd 1.524 x 0.762: 1 -2.794,1.905; 2 2.794,1.905; 3 -2.794,-1.905; 4 2.794,-1.905
RFCMF1220100M4T = smd 0.9 x 0.4: A1 -0.85,0.4; A2 0.85,0.4; B1 -0.85,-0.4; B2 0.85,-0.4
MOSAIC_LGA = smd 0.6 x 0.6: A2 13.97,12.7; A3 13.97,11.43; A4 13.97,10.16; A5 13.97,8.89; A6 13.97,7.62; A7 13.97,6.35; A8 13.97,5.08; A9 13.97,3.81; A10 13.97,2.54; A11 13.97,1.27; A12 13.97,0; A13 13.97,-1.27; A14 13.97,-2.54; A15 13.97,-3.81; A16 13.97,-5.08; A17 13.97,-6.35; A18 13.97,-7.62; A19 13.97,-8.89; A20 13.97,-10.16; A21 13.97,-11.43; A22 13.97,-12.7; A23 13.97,-13.97; AA1 -11.43,13.97; AA2 -11.43,12.7; AA3 -11.43,11.43; AA4 -11.43,10.16; AA5 -11.43,8.89; AA6 -11.43,7.62; AA7 -11.43,6.35; AA8 -11.43,5.08; AA9 -11.43,3.81; AA10 -11.43,2.54; AA11 -11.43,1.27; AA12 -11.43,0; AA13 -11.43,-1.27; AA14 -11.43,-2.54; AA15 -11.43,-3.81; AA16 -11.43,-5.08; AA17 -11.43,-6.35; AA18 -11.43,-7.62; AA19 -11.43,-8.89; AA20 -11.43,-10.16; AA21 -11.43,-11.43; AA22 -11.43,-12.7; AA23 -11.43,-13.97; AB1 -12.7,13.97; AB2 -12.7,12.7; AB3 -12.7,11.43; AB4 -12.7,10.16; AB5 -12.7,8.89; AB6 -12.7,7.62; AB7 -12.7,6.35; AB8 -12.7,5.08; AB9 -12.7,3.81; AB10 -12.7,2.54; AB11 -12.7,1.27; AB12 -12.7,0; AB13 -12.7,-1.27; AB14 -12.7,-2.54; AB15 -12.7,-3.81; AB16 -12.7,-5.08; AB17 -12.7,-6.35; AB18 -12.7,-7.62; AB19 -12.7,-8.89; AB20 -12.7,-10.16; AB21 -12.7,-11.43; AB22 -12.7,-12.7; AB23 -12.7,-13.97; AC1 -13.97,13.97; AC2 -13.97,12.7; AC3 -13.97,11.43; AC4 -13.97,10.16; AC5 -13.97,8.89; AC6 -13.97,7.62; AC7 -13.97,6.35; AC8 -13.97,5.08; AC9 -13.97,3.81; AC10 -13.97,2.54; AC11 -13.97,1.27; AC12 -13.97,0; AC13 -13.97,-1.27; AC14 -13.97,-2.54; AC15 -13.97,-3.81; AC16 -13.97,-5.08; AC17 -13.97,-6.35; AC18 -13.97,-7.62; AC19 -13.97,-8.89; AC20 -13.97,-10.16; AC21 -13.97,-11.43; AC22 -13.97,-12.7; AC23 -13.97,-13.97; B1 12.7,13.97; B2 12.7,12.7; B3 12.7,11.43; B4 12.7,10.16; B5 12.7,8.89; B6 12.7,7.62; B7 12.7,6.35; B8 12.7,5.08; B9 12.7,3.81; B10 12.7,2.54; B11 12.7,1.27; B12 12.7,0; B13 12.7,-1.27; B14 12.7,-2.54; B15 12.7,-3.81; B16 12.7,-5.08; B17 12.7,-6.35; B18 12.7,-7.62; B19 12.7,-8.89; B20 12.7,-10.16; B21 12.7,-11.43; B22 12.7,-12.7; B23 12.7,-13.97; C1 11.43,13.97; C2 11.43,12.7; C3 11.43,11.43; C4 11.43,10.16; C5 11.43,8.89; C6 11.43,7.62; C7 11.43,6.35; C8 11.43,5.08; C9 11.43,3.81; C10 11.43,2.54; C11 11.43,1.27; C12 11.43,0; C13 11.43,-1.27; C14 11.43,-2.54; C15 11.43,-3.81; C16 11.43,-5.08; C17 11.43,-6.35; C18 11.43,-7.62; C19 11.43,-8.89; C20 11.43,-10.16; C21 11.43,-11.43; C22 11.43,-12.7; C23 11.43,-13.97; D1 10.16,13.97; D2 10.16,12.7; D3 10.16,11.43; D21 10.16,-11.43; D22 10.16,-12.7; D23 10.16,-13.97; E1 8.89,13.97; E2 8.89,12.7; E3 8.89,11.43; E21 8.89,-11.43; E22 8.89,-12.7; E23 8.89,-13.97; F1 7.62,13.97; F2 7.62,12.7; F3 7.62,11.43; F21 7.62,-11.43; F22 7.62,-12.7; F23 7.62,-13.97; G1 6.35,13.97; G2 6.35,12.7; G3 6.35,11.43; G21 6.35,-11.43; G22 6.35,-12.7; G23 6.35,-13.97; H1 5.08,13.97; H2 5.08,12.7; H3 5.08,11.43; H21 5.08,-11.43; H22 5.08,-12.7; H23 5.08,-13.97; J1 3.81,13.97; J2 3.81,12.7; J3 3.81,11.43; J21 3.81,-11.43; J22 3.81,-12.7; J23 3.81,-13.97; K1 2.54,13.97; K2 2.54,12.7; K3 2.54,11.43; K21 2.54,-11.43; K22 2.54,-12.7; K23 2.54,-13.97; L1 1.27,13.97; L2 1.27,12.7; L3 1.27,11.43; L21 1.27,-11.43; L22 1.27,-12.7; L23 1.27,-13.97; M1 0,13.97; M2 0,12.7; M3 0,11.43; M21 0,-11.43; M22 0,-12.7; M23 0,-13.97; N1 -1.27,13.97; N2 -1.27,12.7; N3 -1.27,11.43; N21 -1.27,-11.43; N22 -1.27,-12.7; N23 -1.27,-13.97; P1 -2.54,13.97; P2 -2.54,12.7; P3 -2.54,11.43; P21 -2.54,-11.43; P22 -2.54,-12.7; P23 -2.54,-13.97; R1 -3.81,13.97; R2 -3.81,12.7; R3 -3.81,11.43; R21 -3.81,-11.43; R22 -3.81,-12.7; R23 -3.81,-13.97; T1 -5.08,13.97; T2 -5.08,12.7; T3 -5.08,11.43; T21 -5.08,-11.43; T22 -5.08,-12.7; T23 -5.08,-13.97; U1 -6.35,13.97; U2 -6.35,12.7; U3 -6.35,11.43; U21 -6.35,-11.43; U22 -6.35,-12.7; U23 -6.35,-13.97; V1 -7.62,13.97; V2 -7.62,12.7; V3 -7.62,11.43; V21 -7.62,-11.43; V22 -7.62,-12.7; V23 -7.62,-13.97; W1 -8.89,13.97; W2 -8.89,12.7; W3 -8.89,11.43; W21 -8.89,-11.43; W22 -8.89,-12.7; W23 -8.89,-13.97; Y1 -10.16,13.97; Y2 -10.16,12.7; Y3 -10.16,11.43; Y21 -10.16,-11.43; Y22 -10.16,-12.7; Y23 -10.16,-13.97
SOT23-5 = smd 0.55 x 1.2: 1 -0.95,-1.3; 2 0,-1.3; 3 0.95,-1.3; 4 0.95,1.3; 5 -0.95,1.3

### Placement (x,y rotation side)
ANT_V  43.18,31.75 0 bottom
C1  17.78,25.4 0 top
C3  43.18,48.26 90 top
C4  55.24,18.41 0 top
C5  17.78,27.94 0 top
C11  13.97,26.67 0 top
C12  13.97,24.77 180 top
C13  17.78,18.41 180 top
C18  17.78,40.64 0 top
C19  17.78,35.56 0 top
C20  17.78,38.1 0 top
D1  10.16,10.16 90 top
D2  50.8,42.42 0 top
D3  8.89,26.67 180 top
D4  50.8,47.75 0 top
D5  50.8,45.97 0 top
D6  8.89,16.51 180 top
D7  50.8,49.53 0 top
D8  50.8,44.2 0 top
D9  23.37,42.93 90 top
D10  54.61,35.05 270 top
D11  8.89,21.59 270 top
D12  31.75,7.62 270 top
D13  21.59,7.62 270 top
D14  41.91,7.62 270 top
E1  59.69,35.56 270 top
E2  59.69,15.24 270 top
F1  15.24,21.59 90 top
FRAME2  -9.09,-12.7 0 top  (outside the outline)
GP1  43.18,41.91 0 bottom
GP2  43.18,39.37 0 bottom
H1  60.96,48.26 0 top
H2  2.54,48.26 0 top
H3  60.96,2.54 0 top
H4  2.54,2.54 0 top
J1  25.4,1.27 0 top
J2  1.27,21.59 270 top
J3  3.81,35.56 270 top
J4  10.16,1.27 0 top
J5  6.35,10.16 270 top
J6  40.64,1.27 0 top
J7  17.78,49.53 0 top
J8  38.1,1.27 180 top
J9  15.24,1.27 0 top
J12  1.65,21.59 0 bottom
JP1  1.65,10.16 0 bottom
JP21  62.87,50.16 0 top
JP61  0.64,0.64 0 top
JP71  62.87,50.16 0 bottom
JP81  0.64,0.64 0 bottom
LOG  43.18,44.45 0 bottom
LOGO1  SFE_LOGO_NAME_FLAME10_MM  [SFE_LOGO_NAME_FLAME_10MM]  20.32,13.59 0 bottom
LOGO2  6.35,3.81 0 bottom
LOGO4  57.53,6.22 0 top
MEAS  12.7,21.59 270 bottom
PPS  43.18,46.99 0 bottom
PWR  43.18,49.53 0 bottom
Q9  59.69,21.59 90 top
R1  17.78,30.48 180 top
R2  17.78,33.02 0 top
R3  17.78,43.18 0 top
R4  46.99,44.2 180 top
R5  55.24,12.06 0 top
R6  55.24,20.32 0 top
R7  55.24,22.23 0 top
R8  15.24,47.62 270 top
R9  46.99,42.42 180 top
R10  46.99,49.53 180 top
R11  46.99,47.75 180 top
R12  46.99,45.97 180 top
R13  43.18,43.18 270 top
R14  49.53,7.62 0 top
R16  10.16,6.99 180 top
R17  10.16,13.34 180 top
R46  62.23,21.59 270 top
R47  58.42,21.59 270 top
S1  15.24,12.7 270 top
S2  10.16,47.62 180 top
T1  19.05,15.24 0 top
TP1  50.8,7.62 90 bottom
U1  36.83,25.4 180 top
U2  55.24,15.24 270 top
U5  17.78,21.59 0 top
U$1  [V0]  4.19,26.04 0 bottom
U$2  97.79,52.07 0 top  (outside the outline)
U$3  [GNSS_1]  31.37,21.59 0 bottom
U$4  [TRIBAND_2]  31.24,25.4 0 bottom
U$5  [MEAS0]  14.61,21.59 270 bottom
U$6  [_ACTIVE_ANT1]  57.28,40.39 0 top
U$7  [#RTK#0]  45.72,3.94 90 top
U$8  [C4]  4.19,20.7 0 bottom
U$9  [D#2]  4.57,10.79 0 bottom
U$10  [D#3]  4.57,9.53 0 bottom
U$11  [G0]  4.95,8.26 0 bottom
U$12  [R5]  4.19,18.92 0 bottom
U$13  [RST0]  17.78,12.7 90 top
U$14  [RX7]  4.7,24.26 0 bottom
U$15  [TX6]  4.83,22.48 0 bottom
U$16  [V8]  4.95,12.06 0 bottom
U$17  [#EVENTA#0]  53.34,5.46 270 bottom
U$18  [COM30]  6.86,21.46 270 bottom
U$19  [MOSAIC#X50]  58.17,29.34 0 top
U$20  [MOSAIC#X5_0]  31.37,29.21 0 bottom
U$21  [TIME0]  55.88,10.79 0 top
U$22  [G1]  4.19,17.14 0 bottom
U$23  [3V30]  46.48,31.75 0 bottom
U$24  [5V0]  40.26,31.75 0 bottom
U$25  [PULSE1]  59.82,10.79 0 top
U$26  [#ANT_V#0]  43.31,33.53 0 bottom
U$27  [#RTK_LED#0]  48.26,39.37 0 bottom
U$28  [RTK0]  54.61,42.42 0 top
U$29  [PVT0]  54.74,44.2 0 top
U$30  [#GP1_#0]  40.64,3.56 270 bottom
U$31  [LOG0]  10.29,44.2 0 top
U$33  [#GP2_#0]  43.18,3.68 270 bottom
U$34  [#PPS_#0]  50.8,3.56 270 bottom
U$35  [#LOG_BTN#0]  48.26,6.1 270 bottom
U$36  [#LOG_L#0]  38.1,45.85 90 top
U$37  [#RDY#0]  33.02,46.74 270 bottom
U$38  [#GP_LED#0]  35.56,45.21 270 bottom
U$39  [#LOG_LED#0]  38.1,44.7 270 bottom
U$40  [#PMIC#0]  40.64,46.48 270 bottom
U$41  [#RTS#0]  20.32,3.81 270 bottom
U$42  [#RTS#0]  30.48,3.81 270 bottom
U$43  [#RTK_#0]  45.72,3.68 270 bottom
U$44  [#EVENTB#0]  55.88,5.46 270 bottom
U$69  [L1#2#50]  59.05,41.66 0 top
U$79  [LOG2]  54.61,45.97 0 top
U$80  [PPS0]  54.48,47.75 0 top
U$81  [PWR3]  54.74,49.53 0 top
U$82  [COM30]  6.35,21.59 90 top
U$83  [COM20]  27.94,7.62 0 top
U$84  [COM10]  17.78,7.62 0 top
U$85  [COM40]  36.83,7.62 0 top
U$87  [#3#3V#1]  12.7,4.19 90 top
U$88  [#CTS#4]  22.86,3.94 90 top
U$89  [#GND#0]  10.16,4.06 90 top
U$90  [#RTS#5]  20.32,3.94 90 top
U$91  [#RX#2]  15.24,3.56 90 top
U$92  [#TX#3]  17.78,3.56 90 top
U$93  [#3#3V#1]  12.7,4.06 270 bottom
U$94  [#CTS_#4]  22.86,3.68 270 bottom
U$95  [#GND#0]  10.16,3.94 270 bottom
U$97  [#RX_#2]  15.24,3.17 270 bottom
U$98  [#TX_#3]  17.78,3.3 270 bottom
U$99  [COM20]  29.21,7.62 0 bottom
U$100  [#CTS#4]  33.02,3.94 90 top
U$101  [#RTS#5]  30.48,3.94 90 top
U$102  [#RX#2]  25.4,3.56 90 top
U$103  [#TX#3]  27.94,3.56 90 top
U$104  [#CTS_#4]  33.02,3.68 270 bottom
U$106  [#RX_#2]  25.4,3.17 270 bottom
U$107  [#TX_#3]  27.94,3.3 270 bottom
U$108  [COM40]  36.83,7.62 0 bottom
U$109  [COM10]  18.92,7.62 0 bottom
U$110  [#3#3V#1]  20.32,46.74 90 top
U$111  [#RX#2]  35.56,3.56 90 top
U$112  [#TX#3]  38.1,3.56 90 top
U$113  [#GND#0]  17.78,46.86 90 top
U$114  [#3#3V#1]  20.32,46.61 270 bottom
U$115  [#RX_#2]  35.56,3.17 270 bottom
U$116  [#TX_#3]  38.1,3.3 270 bottom
U$117  [#GND#0]  17.78,46.74 270 bottom
U$118  [##RST##2]  30.48,46.99 90 top
U$119  [#GP_LED#4]  35.56,45.34 90 top
U$121  [#PMIC#6]  40.64,46.61 90 top
U$122  [#RDY#3]  33.02,46.86 90 top
U$123  [#VIN#1]  22.86,46.99 90 top
U$124  [#VUSB#0]  25.4,46.35 90 top
U$125  [#V_BAT#7]  27.94,45.59 90 top
U$130  [#VIN#1]  22.86,46.99 270 bottom
U$131  [#VUSB#0]  25.4,46.23 270 bottom
U$132  [#V_BAT#7]  27.94,45.47 270 bottom
U$133  [#_#RST##2]  30.48,46.99 270 bottom
U$134  [L1#2#50]  53.98,35.56 270 bottom
U$135  [_ACTIVE_ANT1]  55.88,35.56 270 bottom
U$136  [TIME0]  53.98,15.24 270 bottom
U$137  [PULSE1]  55.88,15.24 270 bottom
U$138  [GNSS1]  58.17,24.77 0 top
U$140  [TRIBAND2]  58.17,27.05 0 top
U$141  [#LOG_LED#2]  48.26,44.83 0 bottom
U$142  [#PPS_LED#1]  48.13,47.12 0 bottom
U$143  [#GP_LED#3]  47.75,42.42 0 bottom
U$144  [#PWR_LED#0]  48.39,49.53 0 bottom
U$145  [#V_BAT#4]  47.5,36.83 0 bottom
U$146  [#A#8]  53.34,3.05 90 top
U$147  [#B#10]  55.88,2.92 90 top
U$150  [#GP1#0]  40.64,3.81 90 top
U$152  [#GP2#1]  43.18,3.94 90 top
U$154  [#LOG#4]  48.26,4.06 90 top
U$156  [#PPS#6]  50.8,3.81 90 top
VB  43.18,36.83 0 bottom

### Tracks (layer width: path | path; a pad name or v marks a point on that pad's centre or on a via)
1.8V  (via drill 0.3)
  Top/Horz 0.178: U1.AC4 v52.7,13.34 54.83,13.34 R5.2 | R46.2 61.88,21.09 Q9.1 59.83,21.09 v59.56,20.83
  Bottom/Vert 0.178: v59.56,20.83 59.56,24.26 58.29,25.53 53.77,25.53 53.21,24.97 53.21,24.26 54.1,23.37 54.1,14.73 v52.7,13.34
3.3V  (via drill 0.3)
  Top/Horz 0.178: U2.5 56.55,17.2 56.09,17.65 C4.2 56.57,18.41 v57.66,19.51 57.66,19.89 58.42,20.65 R47.2 | U1.C18 v44.21,33.02 | v46.99,23.5 52.83,23.5 v54.1,24.77 | R14.2 v57.15,7.62
  Top/Horz 0.508: C12.2 C11.1 12.06,26.67 11.56,27.18 11.56,29.46 12.57,30.48 R1.2 | U1.B18 U1.C18 U1.C19 U1.C20 | U1.B18 U1.A18 | U1.B18 U1.B19 U1.B20 | U1.A20 U1.A19 U1.A18 | U1.A18 v21.97,33.02 R2.2 | R2.2 18.63,33.95 18.29,34.29 17.14,34.29 16.93,34.51 C19.1 16.93,36.58 | 16.93,36.58 C20.1 C18.1 16.93,41.7 17.14,41.91 18.29,41.91 18.63,42.25 R3.2 18.63,46.7 20.32,48.39 J7.2 | J3.4 16.9,36.61 16.93,36.58 | J4.2 12.7,5.08 v20.32,12.7 | R1.2 16.93,31.41 17.27,31.75 18.16,31.75 18.63,32.22 R2.2 | R1.2 C5.1 C1.1 16.93,24.17 16.83,24.07 U5.5
  Bottom/Vert 0.178: PWR.2 42.66,48.65 43.05,48.26 44.96,48.26 45.72,47.5 45.72,38.09 44.46,36.83 VB.1 43.7,35.31 44.21,34.8 v44.21,33.02 44.2,33.02 44.22,32.99 ANT_V.1 44.22,24.49 45.21,23.5 v46.99,23.5 | v54.1,24.77 56.98,24.77 57.75,24 57.75,19.78 57.66,19.69 v57.66,19.51 56.24,18.09 56.24,8.53 v57.15,7.62
  Bottom/Vert 0.508: v21.97,33.02 22.35,32.64 22.35,14.73 v20.32,12.7
5V  (via drill 0.3)
  Top/Horz 0.305: v42.04,28.57 v42.03,28.58 v20.36,28.58 v20.36,28.57
  Top/Horz 0.508: U5.1 16.83,20.7 | 16.83,20.7 16.83,21.27 17.14,21.59 18.41,21.59 18.73,21.27 U5.3 18.73,19.05 | 18.73,19.05 18.73,18.52 C13.1 | v20.32,19.05 18.73,19.05 | F1.1 15.25,20.7 16.83,20.7
  Bottom/Vert 0.305: v20.32,19.05 20.45,19.18 20.45,28.57 v20.36,28.57 | ANT_V.3 42.14,28.68 v42.04,28.57
!RESET!  (via drill 0.3)
  Top/Horz 0.178: v14.48,13.72 14.99,13.72 16.02,14.75 S1.4 16.04,16.66 16.55,17.16 19.91,17.16 20.95,18.21 20.95,23.5 v21.59,24.13 U1.A11 | v21.59,44.96 23.11,46.48 29.97,46.48 30.48,46.99 J7.6 | D9.3 23.43,43.58 22.93,43.07 21.47,43.07 20.74,42.34 v20.74,42.29 | v14.48,11.65 15.62,11.65 16.04,11.23 S1.3
  Bottom/Vert 0.178: v14.48,13.72 v14.48,11.65 | v21.59,24.13 20.95,24.77 20.95,42.29 | 20.95,42.29 20.95,44.32 v21.59,44.96 | v20.74,42.29 20.95,42.29
ANT_V  (via drill 0.3)
  Top/Horz 0.305: v42.55,35.57 42.55,36.57 42.54,36.57 42.54,39.92 44.24,41.62 44.24,42.97 R13.1 C3.1
  Bottom/Vert 0.305: v42.55,35.57 43.18,34.94 ANT_V.2
CC1
  Top/Horz 0.178: J5.A5 6.71,11.41 8.64,13.34 R17.2
CC2
  Top/Horz 0.178: J5.B5 7.21,8.41 8.64,6.99 R16.2
COM1_CTS
  Top/Horz 0.178: U1.E1 27.94,10.66 24.25,6.97 22.86,6.97 | 22.86,6.97 J9.4 | D13.4 22.86,6.97
COM1_RTS  (via drill 0.3)
  Top/Horz 0.178: U1.C1 23.75,9.78 22.23,9.78 21.42,8.97 21.42,7.12 21.27,6.97 D13.3 20.79,6.57 20.45,6.22 v20.32,6.22
  Bottom/Vert 0.178: v20.32,6.22 J9.3
COM1_RX
  Top/Horz 0.178: U1.B1 22.86,10.16 20.83,10.16 | 20.83,10.16 19.05,10.16 15.24,6.35 J9.1 | D13.1 20.79,10.12 20.83,10.16
COM1_TX
  Top/Horz 0.178: U1.D1 26.67,10.41 24.53,8.27 D13.5 22.01,8.27 21.77,8.03 21.77,6.36 20.5,5.08 19.05,5.08 17.78,3.81 J9.2
COM2_CTS
  Top/Horz 0.178: U1.J1 32.55,10.96 D12.5 33.13,8.27 33.53,7.87 33.53,6.1 33.02,5.59 J1.4
COM2_RTS
  Top/Horz 0.178: J1.3 30.48,5.08 29.46,6.1 29.46,8.26 | U1.G1 30.48,10.41 29.46,9.4 29.46,8.26 | D12.1 29.48,8.27 29.46,8.26
COM2_RX  (via drill 0.3)
  Top/Horz 0.178: U1.F1 29.21,10.79 25.4,6.99 J1.1 | D12.3 31.51,6.97 31.75,6.73 v31.75,5.97
  Bottom/Vert 0.178: v31.75,5.97 31.37,5.59 25.91,5.59 25.4,5.08 J1.1
COM2_TX  (via drill 0.3)
  Top/Horz 0.178: U1.H1 31.75,7.23 32.01,6.97 D12.4 32.55,5.88 v31.75,5.08
  Bottom/Vert 0.178: v31.75,5.08 29.21,5.08 27.94,3.81 J1.2
COM3_CTS  (via drill 0.3)
  Top/Horz 0.178: U1.N1 v38.1,8.26 | D11.4 9.69,20.23 9.4,19.94 6.73,19.94 5.71,20.96 J2.4 2.73,20.96 v1.65,19.88
  Bottom/Vert 0.178: v38.1,8.26 13.89,8.26 6.4,15.74 6.06,15.74 5.08,16.73 5.08,17.82 3.02,19.88 v1.65,19.88 J12.4
COM3_RTS  (via drill 0.3)
  Top/Horz 0.178: U1.L1 v35.56,9.53 | D11.5 10.4,22.24 10.67,21.97 10.67,20.45 9.72,19.49 9.65,19.43 6.35,19.43 | v5.8,17.36 6.35,17.91 6.35,19.43 | v1.65,18.1 3.26,19.71 J2.5 6.07,19.71 6.35,19.43
  Bottom/Vert 0.178: v35.56,9.53 13.63,9.53 6.91,16.25 6.91,16.59 6.56,16.94 6.21,16.94 v5.8,17.36 | v1.65,18.1 J12.5
COM3_RX  (via drill 0.3)
  Top/Horz 0.178: U1.K1 v34.29,10.16 | v1.65,23.44 4.54,23.44 J2.2 5.87,23.46 7.1,22.24 D11.1
  Bottom/Vert 0.178: J12.2 v1.65,23.44 3.02,23.44 4.95,21.5 4.95,19.05 7.26,16.74 7.26,16.39 13.5,10.16 v34.29,10.16
COM3_TX  (via drill 0.3)
  Top/Horz 0.178: U1.M1 v36.83,8.89 | D11.3 7,20.94 5.71,22.23 4.58,22.23 J2.3 4.05,22.21 3.5,21.66 v1.65,21.66 0.76,20.77 0.76,17.78 1.16,17.38 2.94,17.38 3.81,16.51 3.81,15.88 4.11,15.58 5.55,15.58 v6.31,16.34
  Bottom/Vert 0.178: J12.3 v1.65,21.66 | v6.31,16.34 13.76,8.89 v36.83,8.89
COM4_RX  (via drill 0.3)
  Top/Horz 0.178: U1.D3 33.02,20.32 v38.99,20.32 | D14.1 39.21,8.27 35.56,4.62 J8.2
  Bottom/Vert 0.178: J8.2 35.56,3.09 38.86,6.39 38.86,20.19 v38.99,20.32
COM4_TX  (via drill 0.3)
  Top/Horz 0.178: U1.E3 32.89,18.92 v39.62,18.92 | D14.3 38.97,6.97 38.1,6.1 J8.1
  Bottom/Vert 0.178: v39.62,18.92 39.37,18.67 39.37,5.08 38.1,3.81 J8.1
D+
  Top/Horz 0.178: T1.B2 21.19,14.84 U1.A5
D-
  Top/Horz 0.178: T1.A2 20.72,15.64 U1.A6
EVENTA  (via drill 0.3)
  Top/Horz 0.178: R6.2 56.09,20.37 v55.24,21.22
  Bottom/Vert 0.178: J6.6 53.34,9.14 54.52,10.32 54.52,20.61 55.13,21.22 v55.24,21.22
EVENTB  (via drill 0.3)
  Top/Horz 0.178: v56.13,23.37 56.13,22.26 R7.2
  Bottom/Vert 0.178: v56.13,23.37 55.88,23.11 J6.7
GND  (via drill 0.3)
  other vias: 5.08,45.72 19.68,34.8 19.68,31.24 16,26.67 19.56,26.67 13.97,19.05 15.62,19.05 11.94,17.02 4.7,16.26 12.19,13.97 14.48,15.75 13.08,11.56 6.99,14.1 7.11,6.86 12.7,6.99 59.69,19.05 58.42,19.05 57.15,17.78 59.69,11.43 58.42,11.43 60.96,11.43 60.96,13.97 59.69,13.97 58.42,13.97 58.42,16.51 59.69,16.51 60.96,16.51 60.96,19.05 60.96,31.75 59.69,31.75 58.42,31.75 57.15,33.02 58.42,34.16 59.69,34.16 60.96,34.16 60.96,36.96 59.69,36.96 58.42,36.96 57.15,38.1 58.42,39.37 59.69,39.37 60.96,39.37 57.15,31.75 52.96,48.51 52.96,46.74 52.96,44.45 2.54,27.94 40.01,13.34 40.01,15.24 41.4,15.24 40.01,10.29 40.01,12.06 49.53,10.16 47.62,10.16 50.16,15.88 50.16,17.14 48.9,17.14 48.9,15.88 50.16,14.61 50.16,13.34 48.9,20.95 48.9,19.68 48.9,18.41 46.99,35.56 46.99,34.29 46.99,33.02 46.99,31.75 46.99,30.48 46.99,29.21 46.99,27.94 46.99,26.67 52.07,26.67 52.07,27.94 52.07,29.21 52.07,33.02 52.07,31.75 52.07,30.48 52.07,34.29 52.07,36.83 52.07,38.1 52.07,39.37 50.8,40.64 49.53,40.64 46.99,40.64 45.72,35.56 37.47,37.47 37.47,38.61 34.29,40.64 35.56,40.64 32.51,40.64 31.75,35.56 30.48,35.56 29.21,35.56 26.04,37.47 29.84,38.73 31.11,38.73 28.57,38.73 27.3,38.73 27.3,37.47 28.57,37.47 29.84,37.47 31.11,37.47 33.02,35.56 34.29,35.56 35.56,35.56 24.77,36.2 23.5,36.2 23.5,37.47 23.5,38.73 22.1,38.73 22.1,37.47 22.1,36.2 26.04,38.73 26.04,40.01 27.3,40.01 28.57,40.01 29.84,40.01 31.11,40.01 53.21,18.41 52.83,16.38 55.12,14.35 24.77,17.14 23.5,17.14 23.5,18.41 24.77,18.41 23.5,15.88 24.77,15.88 23.5,14.61 27.3,13.34 28.57,13.34 31.11,13.34 34.92,13.34 18.67,39.12 15.75,38.23 23.5,31.11 23.5,29.84 24.77,29.84 24.77,32.26 23.5,32.26 23.5,26.04 19.3,41.78 12.7,8.38 40.01,37.47 41.27,37.47 46.35,37.47 46.35,38.73 47.62,38.73 47.62,37.47 48.9,37.47 50.16,37.47 48.9,36.2 48.9,34.92 48.9,33.66 50.16,33.66 48.9,32.38 48.9,31.11 48.9,29.84 48.9,28.57 48.9,27.3 48.9,38.73 50.16,38.73 41.27,38.73 45.09,38.73 9.02,21.59 25.27,42.93 19.05,6.35 30.48,6.22 42.04,7.62
  pour Top/Horz (isolate 0.203, rank 4): 0,50.8 0,0 63.5,0 63.5,50.8
  pour Bottom/Vert (isolate 0.203, rank 4): 63.5,50.8 63.5,0 0,0 0,50.8
  pour Vert (isolate 0.203, rank 4): 63.5,50.8 63.5,0 0,0 0,50.8
  pour GND/Horz (isolate 0.203, rank 4): 63.5,50.8 63.5,0 0,0 0,50.8
GP1  (via drill 0.3)
  Top/Horz 0.178: v46.99,21.59 46.99,21.42 47.59,20.82 47.59,15.91 U1.AA4 | J6.1 40.64,3.94 42.71,6.01 D14.4
  Bottom/Vert 0.178: v46.99,21.59 41.4,21.59 40.64,20.83 J6.1
GP2  (via drill 0.3)
  Top/Horz 0.178: U1.L3 35.56,15.49 37.08,17.02 v43.18,17.02 | D14.5 43.29,8.27 43.43,8.13 43.43,5.59 43.18,5.33 J6.2
  Bottom/Vert 0.178: J6.2 v43.18,17.02
GPS_ANT1
  Top/Horz 0.349: U1.AC20 D10.1 | D10.1 | D10.1 E1.SIG
LOG_BTN  (via drill 0.3)
  Top/Horz 0.178: U1.K3 34.29,15.24 36.83,17.78 v44.45,17.78 | R8.2 v15.24,44.45 | v46.99,19.05 46.28,19.76 46.28,33.72 45.15,34.85 37.54,34.85 36.2,36.2 36.2,41 35.23,41.96 28.39,41.96 25.8,44.55 22.33,44.55 21.76,43.98 v19.98,43.98 | R14.1 48.68,6.35 48.26,5.93 J6.4
  Bottom/Vert 0.178: 46.99,17.78 46.99,3.81 48.26,2.54 J6.4 | 46.99,17.78 v46.99,19.05 | v44.45,17.78 46.99,17.78 | v15.24,44.45 19.51,44.45 v19.98,43.98
LOG_LED  (via drill 0.3)
  Top/Horz 0.178: U1.B2 24.77,13.34 25.78,13.34 26.04,13.59 26.04,14.22 33.4,21.59 v37.72,21.59 | v39.5,43.18 v39.5,40.64
  Bottom/Vert 0.178: J7.9 38.1,45.72 39.37,44.45 39.5,44.45 | v37.72,21.59 37.72,33.14 39.01,34.44 39.01,38.25 39.5,38.73 v39.5,40.64 | 39.5,44.45 LOG.2 | v39.5,43.18 39.5,44.45
MEAS  (via drill 0.3)
  Top/Horz 0.508: MEAS.4 10.04,17.66 D6.C | D3.C 10.04,24.25 v10.16,24.13
  Bottom/Vert 0.508: MEAS.2 MEAS.4 11.68,20.32 10.16,21.84 v10.16,24.13
MODULE_RDY  (via drill 0.3)
  Top/Horz 0.178: J7.7 33.02,46.99 32,45.97 24.51,45.97 v24.13,45.59 | v21.55,25.4 U1.A12
  Bottom/Vert 0.178: v24.13,45.59 23.62,45.59 21.34,43.31 21.34,25.62 v21.55,25.4
N$1
  Top/Horz 0.178: S2.4 S2.3 14.19,49.53 R8.1
N$2
  Top/Horz 0.178: D4.A R11.1
N$3  (via drill 0.3)
  Top/Horz 0.178: R11.2 44.7,47.75 v44.58,47.62
  Bottom/Vert 0.178: v44.58,47.62 43.95,47.62 43.7,47.37 PPS.1
N$4
  Top/Horz 0.508: MEAS.3 13.59,22.86 13.97,22.48 15.23,22.48 F1.2
  Bottom/Vert 0.508: MEAS.1 MEAS.3
N$5  (via drill 0.3)
  Top/Horz 0.178: R1.1 19.56,29.55 v19.56,29.21 | v12.7,34.29 12.82,34.41 J3.2
  Bottom/Vert 0.178: v19.56,29.21 17.78,29.21 v12.7,34.29
N$6
  Top/Horz 0.178: U1.AC6 53.34,20.32 R6.1
N$7
  Top/Horz 0.178: U1.AC7 51.18,19.05 54.36,22.23 R7.1
N$8
  Top/Horz 0.178: R9.1 D2.A
N$9  (via drill 0.3)
  Top/Horz 0.178: v45.09,41.02 45.09,41.36 R9.2
  Bottom/Vert 0.178: GP2.1 43.7,39.64 v45.09,41.02
N$10
  Top/Horz 0.305: U1.AC17 U1.AC16
N$11
  Top/Horz 0.178: D8.A R4.1
N$12  (via drill 0.3)
  Top/Horz 0.178: v45.09,43.56 45.51,43.56 R4.2
  Bottom/Vert 0.178: v45.09,43.56 43.7,42.18 GP1.1
N$14
  Top/Horz 0.178: R10.1 D7.A
N$15
  Top/Horz 0.305: U1.M23 U1.N23
N$16
  Top/Horz 0.178: D5.A R12.1
N$17  (via drill 0.3)
  Top/Horz 0.178: R12.2 44.7,45.97 v44.45,45.72
  Bottom/Vert 0.178: v44.45,45.72 44.45,45.47 43.7,44.72 LOG.1
N$20  (via drill 0.3)
  Top/Horz 0.178: R10.2 v44.58,49.53
  Bottom/Vert 0.178: v44.58,49.53 PWR.1
N$26
  Top/Horz 0.178: U1.AC3 52.7,12.06 R5.1
PMIC_ON_REQ  (via drill 0.3)
  Top/Horz 0.178: J7.10 40.64,46.99 38.73,45.09 v26.67,45.09 | v26.71,31.11 24.77,31.11 U1.B16
  Bottom/Vert 0.178: v26.67,45.09 26.67,31.11 v26.71,31.11
PPS  (via drill 0.3)
  Top/Horz 0.178: E2.SIG 57.4,15.24 57.15,14.99 57.15,14.35 | 57.15,14.35 57.15,11.05 56.26,10.16 v50.8,10.16 | U2.4 56.61,14.35 57.15,14.35
  Bottom/Vert 0.178: TP1.2 v50.8,10.16
PPS_1V8
  Top/Horz 0.178: U1.AC8 54.61,24.13 61.59,24.13 62.23,23.5 R46.1 61.88,22.09 Q9.2
PPS_3
  Top/Horz 0.178: Q9.3 59.27,21.59 R47.1 57.49,22.44 57.15,22.1 57.15,19.89 56.69,19.43 53.09,19.43 52.07,18.41 52.07,15.88 52.7,15.24 U2.2
PPS_3V3  (via drill 0.3)
  Top/Horz 0.178: v41.78,46.99 41.78,47.75 42.32,48.29 43.79,48.29 44.14,48.64 48.77,48.64 v48.9,48.51
  Bottom/Vert 0.178: PPS.2 v41.78,46.99 | v48.9,48.51 48.9,46.35 48.26,45.72 48.26,7.37 48.53,7.1 TP1.1 J6.5
PVT_LED  (via drill 0.3)
  Top/Horz 0.178: v36.83,27.3 23.5,27.3 U1.A14
  Bottom/Vert 0.178: v36.83,27.3 36.2,27.94 36.2,41.91 | 36.2,41.91 36.2,42.55 35.56,43.18 J7.8 | GP1.2 36.2,41.91
RTK_LED  (via drill 0.3)
  Top/Horz 0.178: v45.72,15.24 45.72,15.32 44.82,16.22 39.08,16.22 v38.1,15.24 U1.M3
  Bottom/Vert 0.178: GP2.2 40.64,39.37 39.37,38.1 39.37,34.29 38.14,33.06 38.14,22.4 38.32,22.22 38.32,15.46 v38.1,15.24 | J6.3 v45.72,15.24
SD_CLK  (via drill 0.3)
  Top/Horz 0.178: J3.5 v12.7,37.72 | U1.AA1 47.68,12.01 47.68,14.33 46.71,15.3 46.71,16.91 45.57,18.05 45.57,33.42 44.85,34.14 34.7,34.14 33.66,35.18 33.66,40.36 32.77,41.25 26.31,41.25 v26.07,41.49 | v17.78,39.46 18.16,39.84 19.14,39.84 19.31,39.66 20.41,39.66 22.06,41.31 v22.06,41.44 22.12,41.38 22.57,41.82 D9.5
  Bottom/Vert 0.178: v17.78,39.46 17.27,39.46 16.15,40.58 13.15,40.58 12.7,40.13 v12.7,37.72 | v26.07,41.49 22.11,41.49 v22.06,41.44
SD_CMD  (via drill 0.3)
  Top/Horz 0.178: R2.1 16.26,33.02 15.75,33.53 v15.75,34.54 15.75,35.05 15.29,35.51 J3.3 | U1.AB1 48.95,12.01 48.95,14.08 48.37,14.66 47.95,14.66 47.07,15.54 47.07,17.06 45.92,18.2 45.92,33.57 45,34.49 35.74,34.49 34.92,35.31 34.92,40.89 34.21,41.6 28.25,41.6 25.65,44.2 22.86,44.2 22.57,43.9 D9.4 20.59,43.58 20.07,43.05 20.07,40.76 v19.69,40.39
  Bottom/Vert 0.178: v15.75,34.54 17.44,36.23 18.79,36.23 19.94,37.39 19.94,40.13 v19.69,40.39
SD_DATA  (via drill 0.3)
  Top/Horz 0.178: J3.7 15.72,39.91 | 15.72,39.91 v15.75,39.88 | R3.1 15.72,41.97 15.72,39.91 | U1.Y1 46.35,12.06 46.35,16.76 45.21,17.91 45.21,33.27 44.7,33.78 33.53,33.78 32.38,34.92 32.38,39.62 31.11,40.89 25.02,40.89 | v17.78,36.83 19.3,36.83 20.45,37.97 20.45,38.73 22.61,40.89 25.02,40.89 | D9.1 24.78,42.28 25.02,42.04 25.02,40.89
  Bottom/Vert 0.178: v15.75,39.88 15.75,39.37 17.78,37.34 v17.78,36.83
USB_D+  (via drill 0.3)
  Top/Horz 0.178: J5.A6 5.2,10.41 4.95,10.16 4.95,9.53 5.08,9.4 6,9.4 J5.B6 7.23,9.41 v7.43,9.21 D1.6 9.85,9.21 10.16,9.53 10.16,11.18 11.2,12.21 13.1,12.21 13.54,12.66 16.21,12.66 16.32,12.76 17.4,13.84 17.4,14.61 17.65,14.86 18.18,14.86 T1.B1
  Bottom/Vert 0.178: JP1.D+ 7.37,9.27 v7.43,9.21
USB_D-  (via drill 0.3)
  Top/Horz 0.178: J5.B7 6.86,10.91 | 6.86,10.91 6.99,10.91 7.11,11.04 v7.48,11.04 7.55,11.11 D1.4 9.59,11.11 11.05,12.57 12.95,12.57 13.4,13.02 16.07,13.02 17.04,13.99 17.04,15.27 17.42,15.64 T1.A1 | J5.A7 6.74,9.91 6.86,10.03 6.86,10.91
  Bottom/Vert 0.178: JP1.D- v7.47,11.05 v7.48,11.04
V_BAT  (via drill 0.3)
  Top/Horz 0.178: v27.94,19.81 27.88,19.75 24.66,19.75 24.13,20.28 U1.B8 | v38.73,31.75 v27.94,31.75
  Bottom/Vert 0.178: J7.5 v27.94,31.75 v27.94,19.81 | VB.2 41.01,36.83 40.12,35.94 40.12,34.53 38.73,33.15 v38.73,31.75
V_USB  (via drill 0.3)
  Top/Horz 0.305: J5.VBUS2 5.39,7.71 4.32,8.78 4.32,11.54 5.39,12.61 J5.VBUS1 | U1.A8 v21.59,20.32
  Top/Horz 0.508: 7.43,12.89 7.15,12.61 J5.VBUS1 | 7.43,12.89 7.75,13.2 D6.A 7.74,17.66 v7.62,17.78 | v7.39,12.93 7.43,12.89 | D1.5 v7.49,10.16
  Bottom/Vert 0.305: v21.59,20.32 21.59,19.05 20.32,17.78 v7.62,17.78
  Bottom/Vert 0.508: J7.4 25.4,48.26 22.86,45.72 10.16,45.72 8.89,44.45 8.89,26.67 7.24,25.02 7.24,18.16 v7.62,17.78 | JP1.VBUS 3.42,12.83 4.21,12.04 6.5,12.04 v7.39,12.93 8.24,12.08 8.24,10.47 7.94,10.16 v7.49,10.16
VANT
  Top/Horz 0.305: U1.P23 U1.R23 40.64,40.64 42.33,42.33 R13.2
VIN  (via drill 0.3)
  Top/Horz 0.508: J2.1 7.19,24.71 7.75,25.27 D3.A 7.74,27.82 v7.62,27.94
  Bottom/Vert 0.508: J7.3 22.86,48.26 21.59,46.99 10.16,46.99 7.44,44.27 7.44,28.12 v7.62,27.94 5.71,26.04 J12.1

### Text on the board
GND/Horz: 2
Vert: 15
Bottom/Vert: v11
Measures: All dimensions in inches.
tDocu: Solder Mask: Red | Layers: 4 | Controlled Impedance: JLC7628 | Finish: ENIG | Thickness: 1.6mm | No clean process | Material: TG155 | N. Seidle